# EAGLE design console-dat (EAGLE 7.6.0)

## Sheet 1 of 4
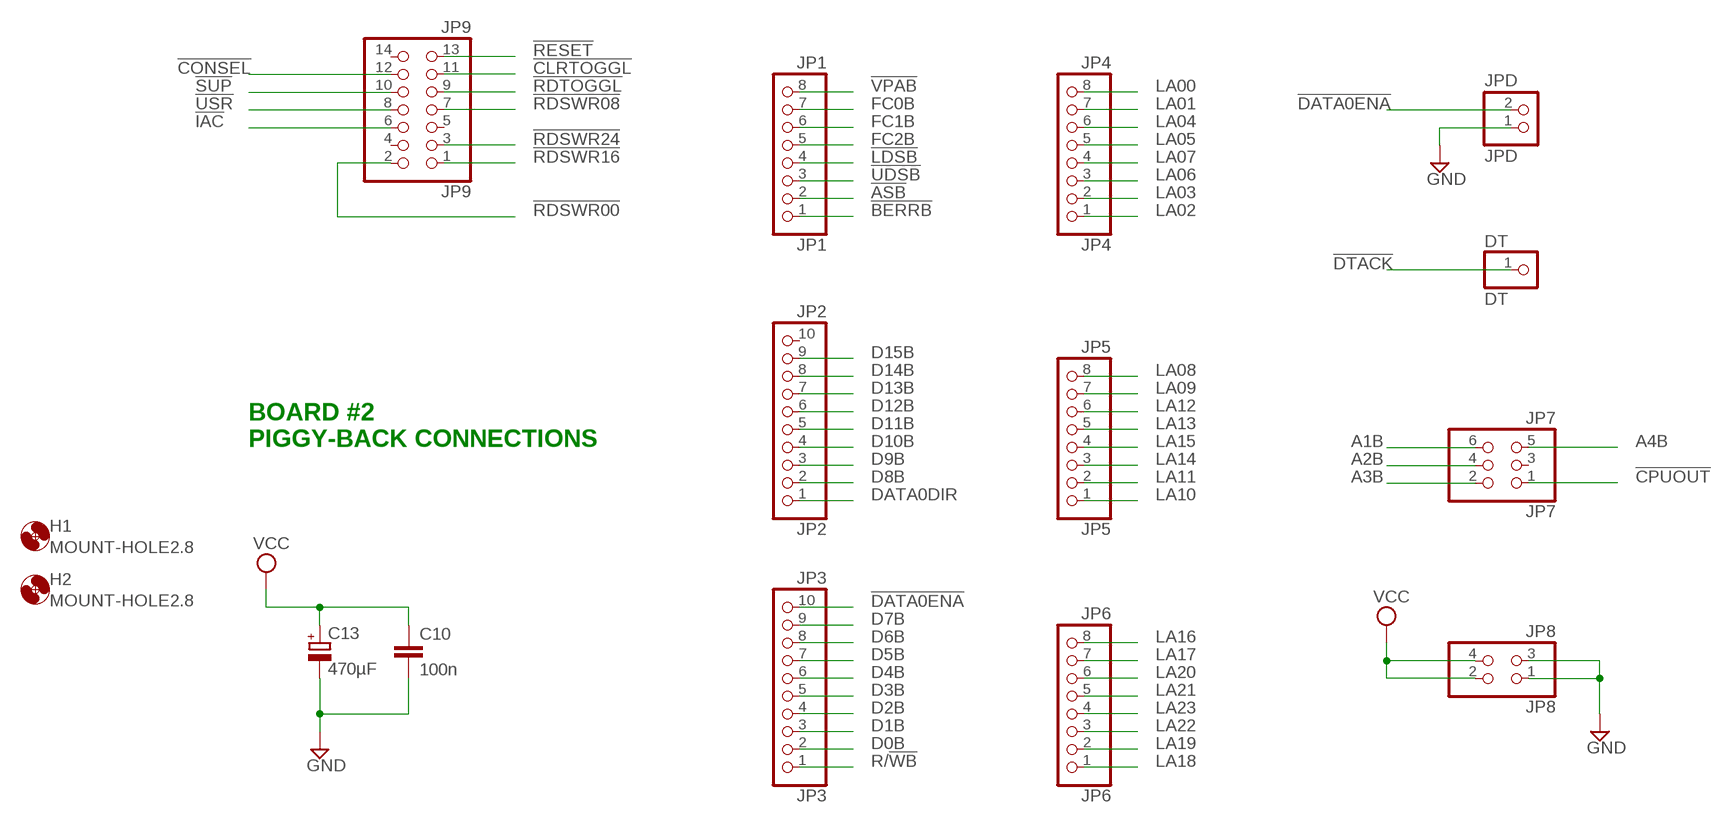
[diagram p0: schematic, sheet 1]

### Parts
C10  100n  C-EU025-024X044  [C025-024X044]
C13  470µF  CPOL-EUE2.5-7  [E2,5-7]
DT  DT  PINHD-1X1  [1X01]
H1  MOUNT-HOLE2.8  [2,8]
H2  MOUNT-HOLE2.8  [2,8]
JP1  JP1  PINHD-1X8  [1X08]
JP2  JP2  PINHD-1X10  [1X10]
JP3  JP3  PINHD-1X10  [1X10]
JP4  JP4  PINHD-1X8  [1X08]
JP5  JP5  PINHD-1X8  [1X08]
JP6  JP6  PINHD-1X8  [1X08]
JP7  JP7  PINHD-2X3  [2X03]
JP8  JP8  PINHD-2X2  [2X02]
JP9  JP9  PINHD-2X7  [2X07]
JPD  JPD  PINHD-1X2  [1X02]

### Nets
!ASB: JP1.2
!BERRB: JP1.1
!CLRTOGGL: JP9.11 ; also sheet 3
!CONSEL: JP9.12 ; also sheet 3
!CPUOUT: JP7.1 ; also sheet 2,3
!DATA0ENA: JP3.10 JPD.2
!DTACK: DT.1 ; also sheet 3
!IAC: JP9.6 ; also sheet 4
!LDSB: JP1.4 ; also sheet 3,4
!RDSWR00: JP9.2 ; also sheet 3
!RDSWR08: JP9.7 ; also sheet 3
!RDSWR16: JP9.1 ; also sheet 3
!RDSWR24: JP9.3 ; also sheet 3
!RDTOGGL: JP9.9 ; also sheet 3
!RESET: JP9.13 ; also sheet 3,4
!SUP: JP9.10 ; also sheet 4
!UDSB: JP1.3 ; also sheet 3,4
!USR: JP9.8 ; also sheet 4
!VPAB: JP1.8 ; also sheet 4
A1B: JP7.6 ; also sheet 3
A2B: JP7.4 ; also sheet 3
A3B: JP7.2 ; also sheet 3
A4B: JP7.5 ; also sheet 3
D0B: JP3.2 ; also sheet 2,4
D1B: JP3.3 ; also sheet 2,4
D2B: JP3.4 ; also sheet 2,4
D3B: JP3.5 ; also sheet 2,4
D4B: JP3.6 ; also sheet 2,4
D5B: JP3.7 ; also sheet 2,4
D6B: JP3.8 ; also sheet 2,4
D7B: JP3.9 ; also sheet 2,4
D8B: JP2.2 ; also sheet 2
D9B: JP2.3 ; also sheet 2
D10B: JP2.4 ; also sheet 2
D11B: JP2.5 ; also sheet 2
D12B: JP2.6 ; also sheet 2
D13B: JP2.7 ; also sheet 2
D14B: JP2.8 ; also sheet 2
D15B: JP2.9 ; also sheet 2
DATA0DIR: JP2.1 ; also sheet 3
FC0B: JP1.7 ; also sheet 4
FC1B: JP1.6 ; also sheet 4
FC2B: JP1.5 ; also sheet 4
GND [Power]: C10.2 C13.- JP8.1 JP8.3 JPD.1 ; also sheet 2,3,4
LA00: JP4.8 ; also sheet 4
LA01: JP4.7 ; also sheet 4
LA02: JP4.1 ; also sheet 4
LA03: JP4.2 ; also sheet 4
LA04: JP4.6 ; also sheet 4
LA05: JP4.5 ; also sheet 4
LA06: JP4.3 ; also sheet 4
LA07: JP4.4 ; also sheet 4
LA08: JP5.8 ; also sheet 4
LA09: JP5.7 ; also sheet 4
LA10: JP5.1 ; also sheet 4
LA11: JP5.2 ; also sheet 4
LA12: JP5.6 ; also sheet 4
LA13: JP5.5 ; also sheet 4
LA14: JP5.3 ; also sheet 4
LA15: JP5.4 ; also sheet 4
LA16: JP6.8 ; also sheet 4
LA17: JP6.7 ; also sheet 4
LA18: JP6.1 ; also sheet 4
LA19: JP6.2 ; also sheet 4
LA20: JP6.6 ; also sheet 4
LA21: JP6.5 ; also sheet 4
LA22: JP6.3 ; also sheet 4
LA23: JP6.4 ; also sheet 4
R/!WB: JP3.1 ; also sheet 3,4
VCC [Power]: C10.1 C13.+ JP8.2 JP8.4 ; also sheet 2,3,4
Unconnected: JP2.10 JP7.3 JP9.4 JP9.5 JP9.14

### Notes on the sheet
- BOARD #2
  PIGGY-BACK CONNECTIONS

## Sheet 2 of 4
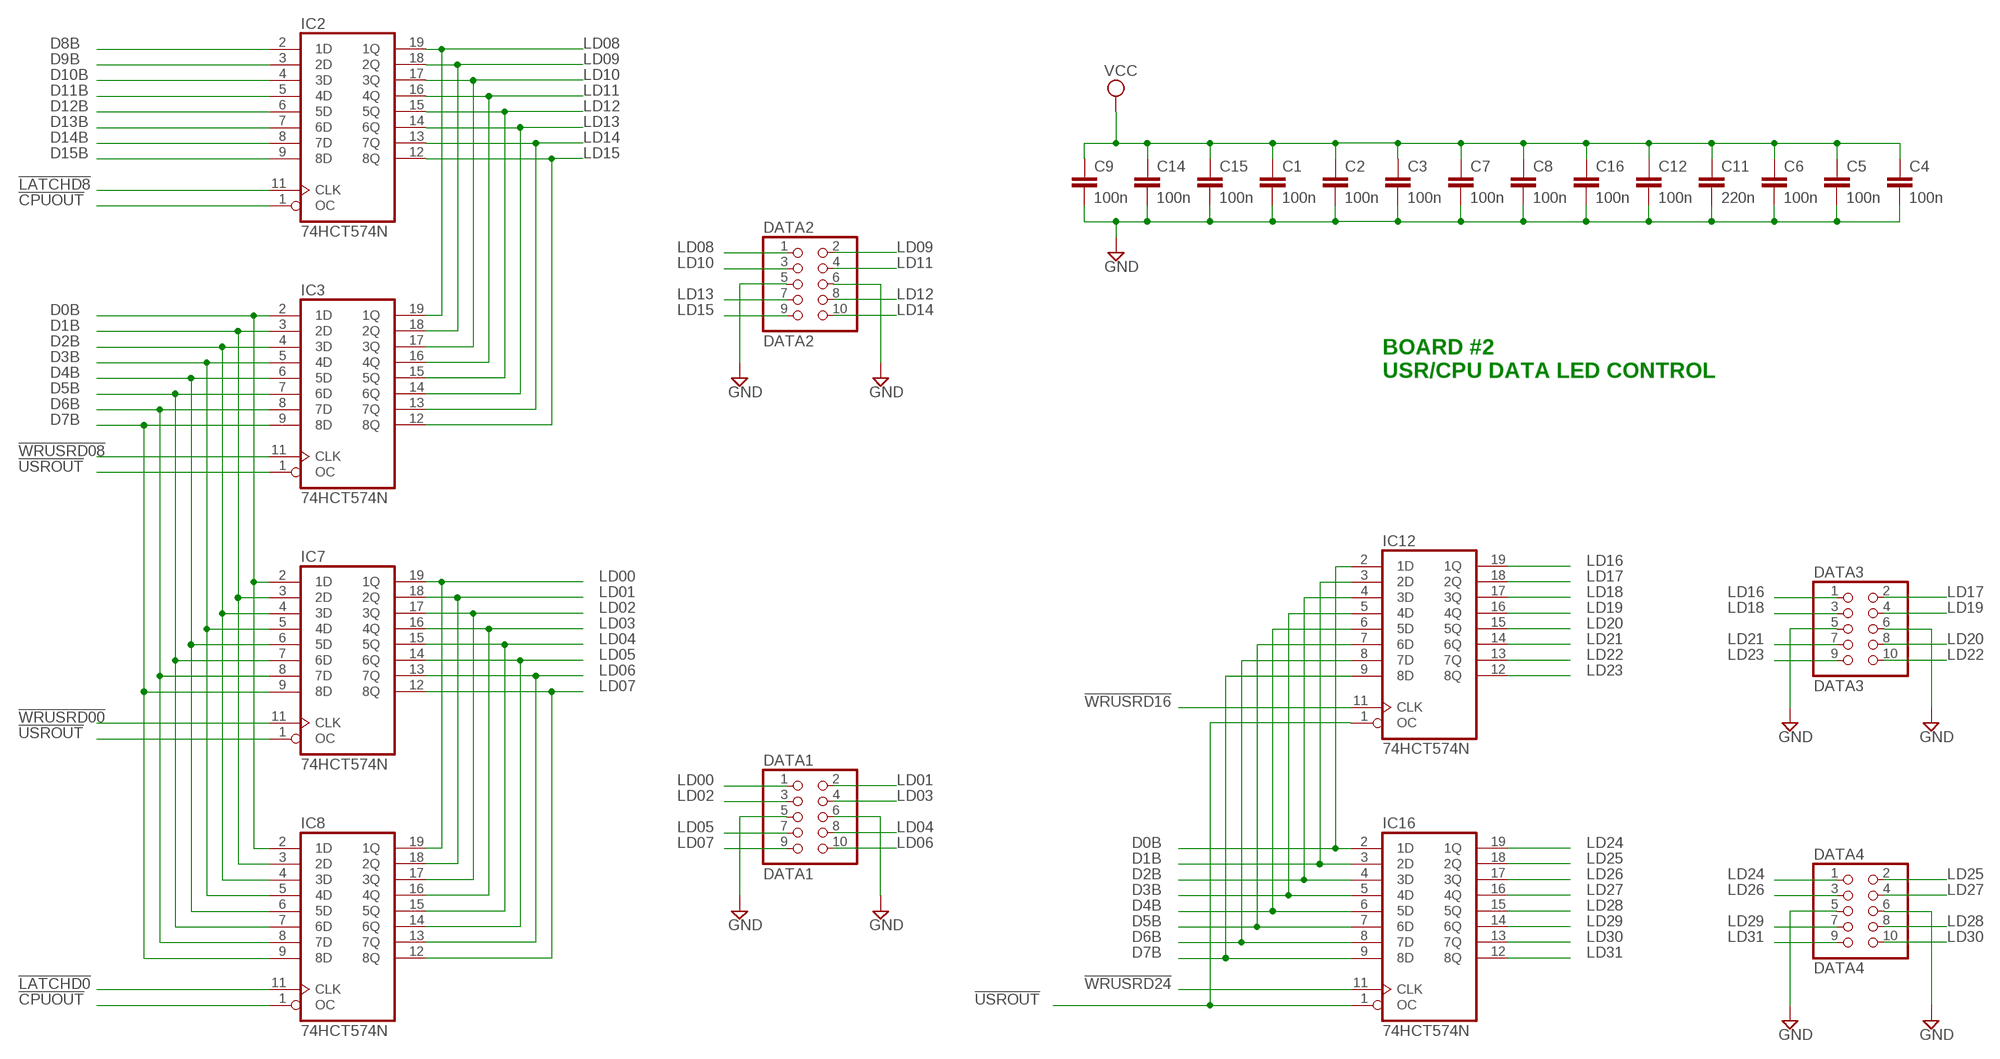
[diagram p1: schematic, sheet 2]

### Parts
C1  100n  C-EU025-024X044  [C025-024X044]
C2  100n  C-EU025-024X044  [C025-024X044]
C3  100n  C-EU025-024X044  [C025-024X044]
C4  100n  C-EU025-024X044  [C025-024X044]
C5  100n  C-EU025-024X044  [C025-024X044]
C6  100n  C-EU025-024X044  [C025-024X044]
C7  100n  C-EU025-024X044  [C025-024X044]
C8  100n  C-EU025-024X044  [C025-024X044]
C9  100n  C-EU025-024X044  [C025-024X044]
C11  220n  C-EU025-024X044  [C025-024X044]
C12  100n  C-EU025-024X044  [C025-024X044]
C14  100n  C-EU025-024X044  [C025-024X044]
C15  100n  C-EU025-024X044  [C025-024X044]
C16  100n  C-EU025-024X044  [C025-024X044]
DATA1  DATA1  PINHD-2X5  [2X05]
DATA2  DATA2  PINHD-2X5  [2X05]
DATA3  DATA3  PINHD-2X5  [2X05]
DATA4  DATA4  PINHD-2X5  [2X05]
IC2  74HCT574N  [DIL20]
IC3  74HCT574N  [DIL20]
IC7  74HCT574N  [DIL20]
IC8  74HCT574N  [DIL20]
IC12  74HCT574N  [DIL20]
IC16  74HCT574N  [DIL20]

### Nets
!CPUOUT: IC2.1(OC) IC8.1(OC) ; also sheet 1,3
!LATCHD0: IC8.11(CLK) ; also sheet 3
!LATCHD8: IC2.11(CLK) ; also sheet 3
!USROUT: IC3.1(OC) IC7.1(OC) IC12.1(OC) IC16.1(OC) ; also sheet 3,4
!WRUSRD00: IC7.11(CLK) ; also sheet 3
!WRUSRD08: IC3.11(CLK) ; also sheet 3
!WRUSRD16: IC12.11(CLK) ; also sheet 3
!WRUSRD24: IC16.11(CLK) ; also sheet 3
D0B: IC3.2(1D) IC7.2(1D) IC8.2(1D) IC12.2(1D) IC16.2(1D) ; also sheet 1,4
D1B: IC3.3(2D) IC7.3(2D) IC8.3(2D) IC12.3(2D) IC16.3(2D) ; also sheet 1,4
D2B: IC3.4(3D) IC7.4(3D) IC8.4(3D) IC12.4(3D) IC16.4(3D) ; also sheet 1,4
D3B: IC3.5(4D) IC7.5(4D) IC8.5(4D) IC12.5(4D) IC16.5(4D) ; also sheet 1,4
D4B: IC3.6(5D) IC7.6(5D) IC8.6(5D) IC12.6(5D) IC16.6(5D) ; also sheet 1,4
D5B: IC3.7(6D) IC7.7(6D) IC8.7(6D) IC12.7(6D) IC16.7(6D) ; also sheet 1,4
D6B: IC3.8(7D) IC7.8(7D) IC8.8(7D) IC12.8(7D) IC16.8(7D) ; also sheet 1,4
D7B: IC3.9(8D) IC7.9(8D) IC8.9(8D) IC12.9(8D) IC16.9(8D) ; also sheet 1,4
D8B: IC2.2(1D) ; also sheet 1
D9B: IC2.3(2D) ; also sheet 1
D10B: IC2.4(3D) ; also sheet 1
D11B: IC2.5(4D) ; also sheet 1
D12B: IC2.6(5D) ; also sheet 1
D13B: IC2.7(6D) ; also sheet 1
D14B: IC2.8(7D) ; also sheet 1
D15B: IC2.9(8D) ; also sheet 1
GND [Power]: C1.2 C2.2 C3.2 C4.2 C5.2 C6.2 C7.2 C8.2 C9.2 C11.2 C12.2 C14.2 C15.2 C16.2 DATA1.5 DATA1.6 DATA2.5 DATA2.6 DATA3.5 DATA3.6 DATA4.5 DATA4.6 ; also sheet 1,3,4
LD00: DATA1.1 IC7.19(1Q) IC8.19(1Q)
LD01: DATA1.2 IC7.18(2Q) IC8.18(2Q)
LD02: DATA1.3 IC7.17(3Q) IC8.17(3Q)
LD03: DATA1.4 IC7.16(4Q) IC8.16(4Q)
LD04: DATA1.8 IC7.15(5Q) IC8.15(5Q)
LD05: DATA1.7 IC7.14(6Q) IC8.14(6Q)
LD06: DATA1.10 IC7.13(7Q) IC8.13(7Q)
LD07: DATA1.9 IC7.12(8Q) IC8.12(8Q)
LD08: DATA2.1 IC2.19(1Q) IC3.19(1Q)
LD09: DATA2.2 IC2.18(2Q) IC3.18(2Q)
LD10: DATA2.3 IC2.17(3Q) IC3.17(3Q)
LD11: DATA2.4 IC2.16(4Q) IC3.16(4Q)
LD12: DATA2.8 IC2.15(5Q) IC3.15(5Q)
LD13: DATA2.7 IC2.14(6Q) IC3.14(6Q)
LD14: DATA2.10 IC2.13(7Q) IC3.13(7Q)
LD15: DATA2.9 IC2.12(8Q) IC3.12(8Q)
LD16: DATA3.1 IC12.19(1Q)
LD17: DATA3.2 IC12.18(2Q)
LD18: DATA3.3 IC12.17(3Q)
LD19: DATA3.4 IC12.16(4Q)
LD20: DATA3.8 IC12.15(5Q)
LD21: DATA3.7 IC12.14(6Q)
LD22: DATA3.10 IC12.13(7Q)
LD23: DATA3.9 IC12.12(8Q)
LD24: DATA4.1 IC16.19(1Q)
LD25: DATA4.2 IC16.18(2Q)
LD26: DATA4.3 IC16.17(3Q)
LD27: DATA4.4 IC16.16(4Q)
LD28: DATA4.8 IC16.15(5Q)
LD29: DATA4.7 IC16.14(6Q)
LD30: DATA4.10 IC16.13(7Q)
LD31: DATA4.9 IC16.12(8Q)
VCC [Power]: C1.1 C2.1 C3.1 C4.1 C5.1 C6.1 C7.1 C8.1 C9.1 C11.1 C12.1 C14.1 C15.1 C16.1 ; also sheet 1,3,4

### Notes on the sheet
- BOARD #2
  USR/CPU DATA LED CONTROL

## Sheet 3 of 4
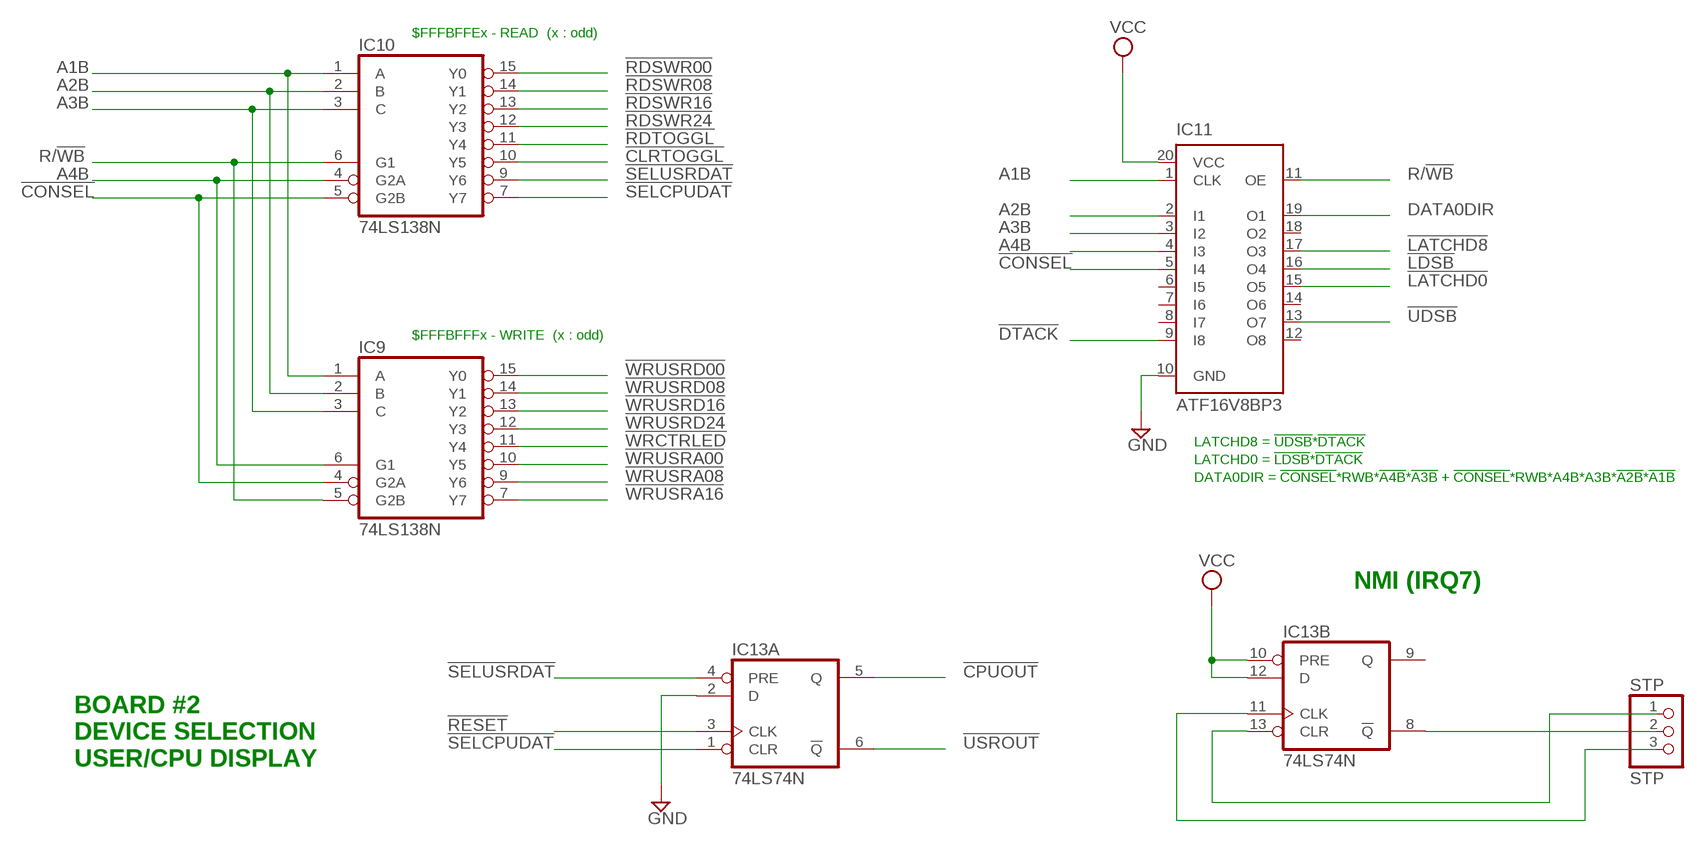
[diagram p2: schematic, sheet 3]

### Parts
IC9  74LS138N  [DIL16]
IC10  74LS138N  [DIL16]
IC11  ATF16V8BP3  [DIL20]
IC13  74LS74N  [DIL14]
STP  STP  PINHD-1X3  [1X03]

### Nets
!CLRTOGGL: IC10.10(Y5) ; also sheet 1
!CONSEL: IC9.4(G2A) IC10.5(G2B) IC11.5(I4) ; also sheet 1
!CPUOUT: IC13.5(A:Q) ; also sheet 1,2
!DTACK: IC11.9(I8) ; also sheet 1
!LATCHD0: IC11.15(O5) ; also sheet 2
!LATCHD8: IC11.17(O3) ; also sheet 2
!LDSB: IC11.16(O4) ; also sheet 1,4
!RDSWR00: IC10.15(Y0) ; also sheet 1
!RDSWR08: IC10.14(Y1) ; also sheet 1
!RDSWR16: IC10.13(Y2) ; also sheet 1
!RDSWR24: IC10.12(Y3) ; also sheet 1
!RDTOGGL: IC10.11(Y4) ; also sheet 1
!RESET: IC13.3(A:CLK) ; also sheet 1,4
!SELCPUDAT: IC10.7(Y7) IC13.1(A:CLR)
!SELUSRDAT: IC10.9(Y6) IC13.4(A:PRE)
!UDSB: IC11.13(O7) ; also sheet 1,4
!USROUT: IC13.6(A:!Q) ; also sheet 2,4
!WRCTRLED: IC9.11(Y4) ; also sheet 4
!WRUSRA00: IC9.10(Y5) ; also sheet 4
!WRUSRA08: IC9.9(Y6) ; also sheet 4
!WRUSRA16: IC9.7(Y7) ; also sheet 4
!WRUSRD00: IC9.15(Y0) ; also sheet 2
!WRUSRD08: IC9.14(Y1) ; also sheet 2
!WRUSRD16: IC9.13(Y2) ; also sheet 2
!WRUSRD24: IC9.12(Y3) ; also sheet 2
A1B: IC9.1(A) IC10.1(A) IC11.1(CLK) ; also sheet 1
A2B: IC9.2(B) IC10.2(B) IC11.2(I1) ; also sheet 1
A3B: IC9.3(C) IC10.3(C) IC11.3(I2) ; also sheet 1
A4B: IC9.6(G1) IC10.4(G2A) IC11.4(I3) ; also sheet 1
DATA0DIR: IC11.19(O1) ; also sheet 1
GND [Power]: IC11.10(GND) IC13.2(A:D) ; also sheet 1,2,4
N$31: IC13.11(B:CLK) STP.3
N$32: IC13.8(B:!Q) STP.2
N$33: IC13.13(B:CLR) STP.1
R/!WB: IC9.5(G2B) IC10.6(G1) IC11.11(OE) ; also sheet 1,4
VCC [Power]: IC11.20(VCC) IC13.10(B:PRE) IC13.12(B:D) ; also sheet 1,2,4
Unconnected: IC11.6(I5) IC11.7(I6) IC11.8(I7) IC11.12(O8) IC11.14(O6) IC11.18(O2) IC13.9(B:Q)

### Notes on the sheet
- $FFFBFFEx - READ  (x : odd)
- $FFFBFFFx - WRITE  (x : odd)
- LATCHD8 = !UDSB!*!DTACK
- LATCHD0 = !LDSB!*!DTACK
- DATA0DIR = !CONSEL!*RWB*!A4B!*!A3B! + !CONSEL!*RWB*A4B*A3B*!A2B!*!A1B!
- NMI (IRQ7)
- BOARD #2
  DEVICE SELECTION
  USER/CPU DISPLAY

## Sheet 4 of 4
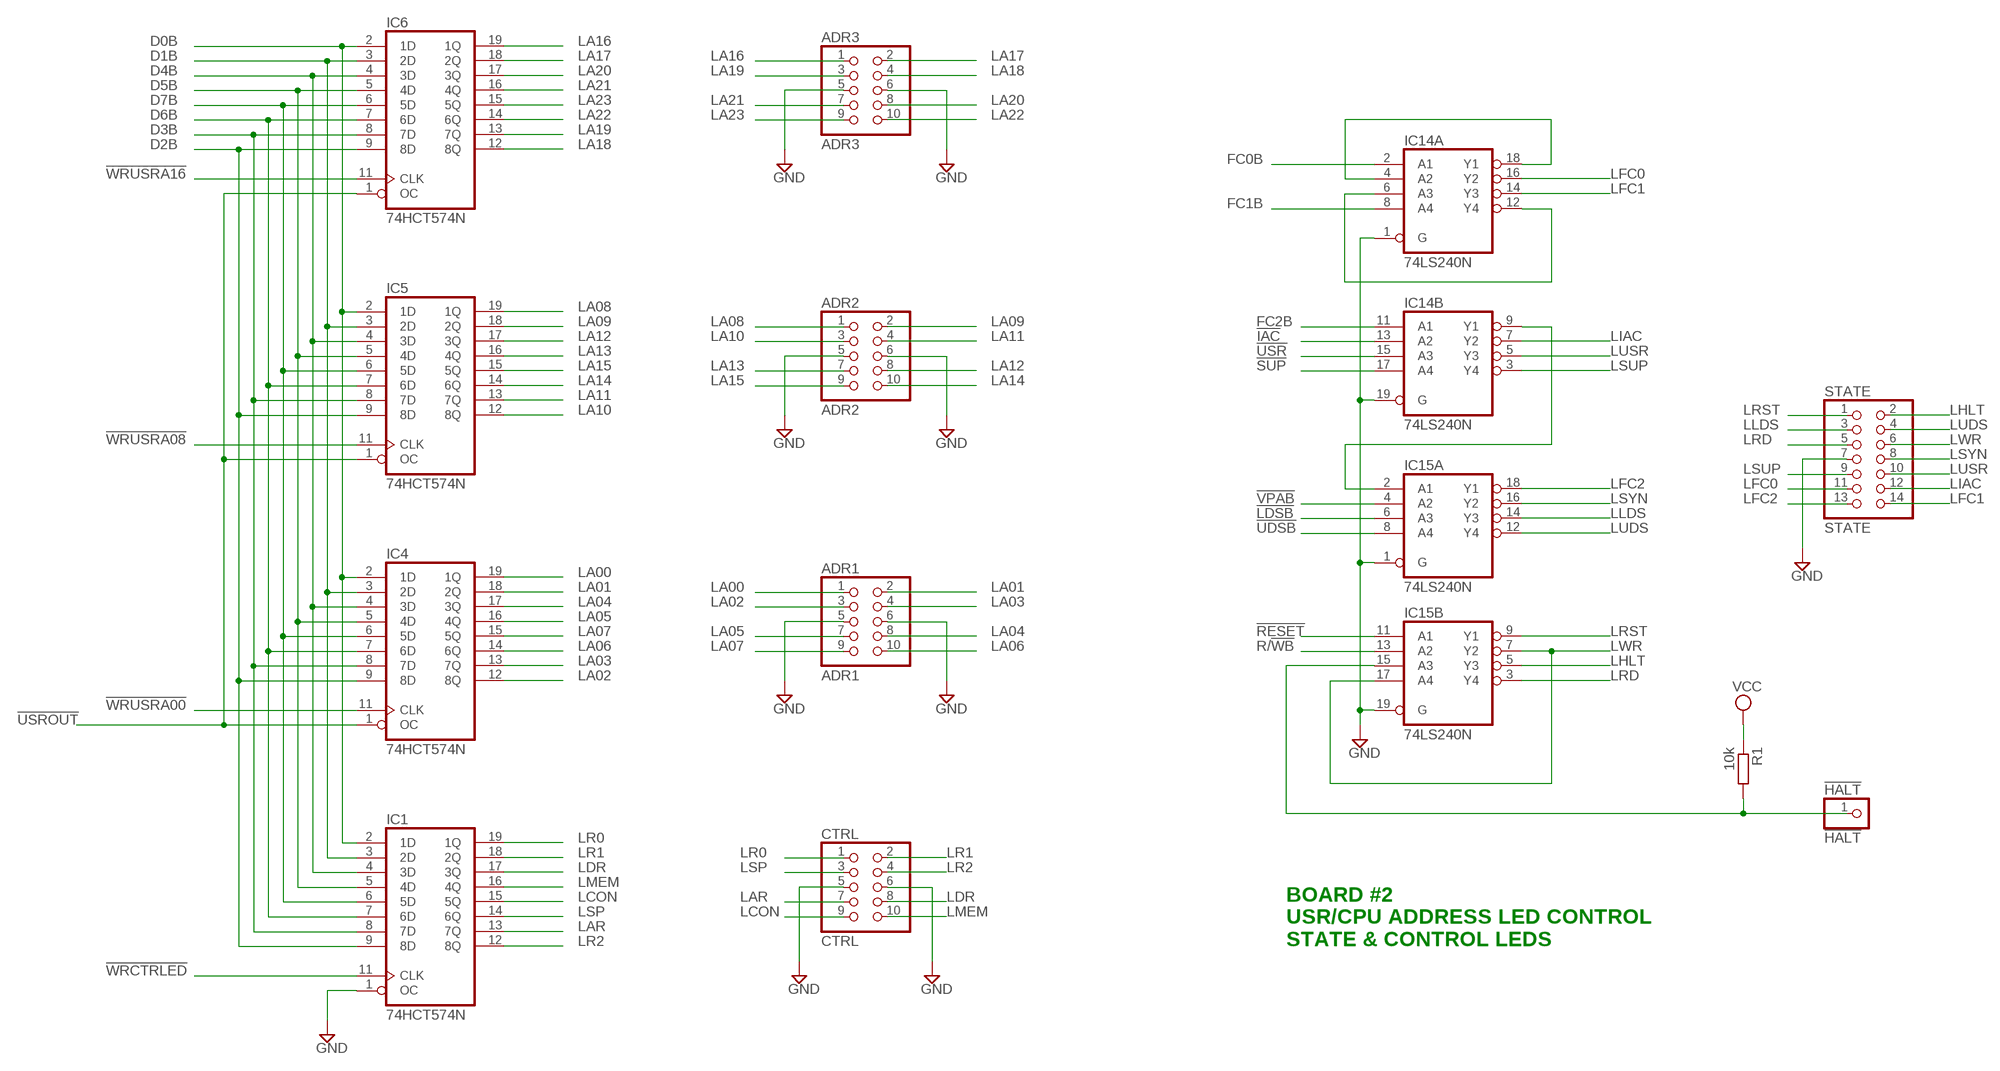
[diagram p3: schematic, sheet 4]

### Parts
!HALT  !HALT  PINHD-1X1  [1X01]
ADR1  ADR1  PINHD-2X5  [2X05]
ADR2  ADR2  PINHD-2X5  [2X05]
ADR3  ADR3  PINHD-2X5  [2X05]
CTRL  CTRL  PINHD-2X5  [2X05]
IC1  74HCT574N  [DIL20]
IC4  74HCT574N  [DIL20]
IC5  74HCT574N  [DIL20]
IC6  74HCT574N  [DIL20]
IC14  74LS240N  [DIL20]
IC15  74LS240N  [DIL20]
R1  10k  R-EU_0204/7  [0204/7]
STATE  STATE  PINHD-2X7  [2X07]

### Nets
!IAC: IC14.13(B:A2) ; also sheet 1
!LDSB: IC15.6(A:A3) ; also sheet 1,3
!RESET: IC15.11(B:A1) ; also sheet 1,3
!SUP: IC14.17(B:A4) ; also sheet 1
!UDSB: IC15.8(A:A4) ; also sheet 1,3
!USR: IC14.15(B:A3) ; also sheet 1
!USROUT: IC4.1(OC) IC5.1(OC) IC6.1(OC) ; also sheet 2,3
!VPAB: IC15.4(A:A2) ; also sheet 1
!WRCTRLED: IC1.11(CLK) ; also sheet 3
!WRUSRA00: IC4.11(CLK) ; also sheet 3
!WRUSRA08: IC5.11(CLK) ; also sheet 3
!WRUSRA16: IC6.11(CLK) ; also sheet 3
D0B: IC1.2(1D) IC4.2(1D) IC5.2(1D) IC6.2(1D) ; also sheet 1,2
D1B: IC1.3(2D) IC4.3(2D) IC5.3(2D) IC6.3(2D) ; also sheet 1,2
D2B: IC1.9(8D) IC4.9(8D) IC5.9(8D) IC6.9(8D) ; also sheet 1,2
D3B: IC1.8(7D) IC4.8(7D) IC5.8(7D) IC6.8(7D) ; also sheet 1,2
D4B: IC1.4(3D) IC4.4(3D) IC5.4(3D) IC6.4(3D) ; also sheet 1,2
D5B: IC1.5(4D) IC4.5(4D) IC5.5(4D) IC6.5(4D) ; also sheet 1,2
D6B: IC1.7(6D) IC4.7(6D) IC5.7(6D) IC6.7(6D) ; also sheet 1,2
D7B: IC1.6(5D) IC4.6(5D) IC5.6(5D) IC6.6(5D) ; also sheet 1,2
FC0B: IC14.2(A:A1) ; also sheet 1
FC1B: IC14.8(A:A4) ; also sheet 1
FC2B: IC14.11(B:A1) ; also sheet 1
GND [Power]: ADR1.5 ADR1.6 ADR2.5 ADR2.6 ADR3.5 ADR3.6 CTRL.5 CTRL.6 IC1.1(OC) IC14.1(A:G) IC14.19(B:G) IC15.1(A:G) IC15.19(B:G) STATE.7 ; also sheet 1,2,3
LA00: ADR1.1 IC4.19(1Q) ; also sheet 1
LA01: ADR1.2 IC4.18(2Q) ; also sheet 1
LA02: ADR1.3 IC4.12(8Q) ; also sheet 1
LA03: ADR1.4 IC4.13(7Q) ; also sheet 1
LA04: ADR1.8 IC4.17(3Q) ; also sheet 1
LA05: ADR1.7 IC4.16(4Q) ; also sheet 1
LA06: ADR1.10 IC4.14(6Q) ; also sheet 1
LA07: ADR1.9 IC4.15(5Q) ; also sheet 1
LA08: ADR2.1 IC5.19(1Q) ; also sheet 1
LA09: ADR2.2 IC5.18(2Q) ; also sheet 1
LA10: ADR2.3 IC5.12(8Q) ; also sheet 1
LA11: ADR2.4 IC5.13(7Q) ; also sheet 1
LA12: ADR2.8 IC5.17(3Q) ; also sheet 1
LA13: ADR2.7 IC5.16(4Q) ; also sheet 1
LA14: ADR2.10 IC5.14(6Q) ; also sheet 1
LA15: ADR2.9 IC5.15(5Q) ; also sheet 1
LA16: ADR3.1 IC6.19(1Q) ; also sheet 1
LA17: ADR3.2 IC6.18(2Q) ; also sheet 1
LA18: ADR3.4 IC6.12(8Q) ; also sheet 1
LA19: ADR3.3 IC6.13(7Q) ; also sheet 1
LA20: ADR3.8 IC6.17(3Q) ; also sheet 1
LA21: ADR3.7 IC6.16(4Q) ; also sheet 1
LA22: ADR3.10 IC6.14(6Q) ; also sheet 1
LA23: ADR3.9 IC6.15(5Q) ; also sheet 1
LAR: CTRL.7 IC1.13(7Q)
LCON: CTRL.9 IC1.15(5Q)
LDR: CTRL.8 IC1.17(3Q)
LFC0: IC14.16(A:Y2) STATE.11
LFC1: IC14.14(A:Y3) STATE.14
LFC2: IC15.18(A:Y1) STATE.13
LHLT: IC15.5(B:Y3) STATE.2
LIAC: IC14.7(B:Y2) STATE.12
LLDS: IC15.14(A:Y3) STATE.3
LMEM: CTRL.10 IC1.16(4Q)
LR0: CTRL.1 IC1.19(1Q)
LR1: CTRL.2 IC1.18(2Q)
LR2: CTRL.4 IC1.12(8Q)
LRD: IC15.3(B:Y4) STATE.5
LRST: IC15.9(B:Y1) STATE.1
LSP: CTRL.3 IC1.14(6Q)
LSUP: IC14.3(B:Y4) STATE.9
LSYN: IC15.16(A:Y2) STATE.8
LUDS: IC15.12(A:Y4) STATE.4
LUSR: IC14.5(B:Y3) STATE.10
LWR: IC15.7(B:Y2) IC15.17(B:A4) STATE.6
N$1: IC14.4(A:A2) IC14.18(A:Y1)
N$2: IC14.9(B:Y1) IC15.2(A:A1)
N$3: IC14.6(A:A3) IC14.12(A:Y4)
N$4: !HALT.1 IC15.15(B:A3) R1.2
R/!WB: IC15.13(B:A2) ; also sheet 1,3
VCC [Power]: R1.1 ; also sheet 1,2,3

### Notes on the sheet
- BOARD #2
  USR/CPU ADDRESS LED CONTROL
  STATE & CONTROL LEDS

## Power pins joined to a net without a drawn wire
GND: IC1.10(GND) IC2.10(GND) IC3.10(GND) IC4.10(GND) IC5.10(GND) IC6.10(GND) IC7.10(GND) IC8.10(GND) IC9.8(GND) IC10.8(GND) IC12.10(GND) IC13.7(P:GND) IC14.10(P:GND) IC15.10(P:GND) IC16.10(GND)
VCC: IC1.20(VCC) IC2.20(VCC) IC3.20(VCC) IC4.20(VCC) IC5.20(VCC) IC6.20(VCC) IC7.20(VCC) IC8.20(VCC) IC9.16(VCC) IC10.16(VCC) IC12.20(VCC) IC13.14(P:VCC) IC14.20(P:VCC) IC15.20(P:VCC) IC16.20(VCC)

## Library data of the parts
!HALT DT = pinhead:PINHD-1X1: PIN HEADER
ADR1-ADR3 CTRL DATA1-DATA4 = pinhead:PINHD-2X5: PIN HEADER
C1-C12 C14-C16 = rcl:C-EU: CAPACITOR, European symbol
C13 = rcl:CPOL-EU: POLARIZED CAPACITOR, European symbol
H1 H2 = holes:MOUNT-HOLE: MOUNTING HOLE with drill center marker
IC1-IC8 IC12 IC16 = 74xx-eu:74*574: 8-bit D type FLIP FLOP bus driver
IC9 IC10 = 74xx-eu:74*138: 3-line to 8-line DECODER/DEMULTIPLEXER
IC11 = atmel:ATF16V8B: High perfomance CMOS (electrically erasable) programmable logic device (PLD) ABLE-Atmel-ABEL - P18V8R, P16V8C, P16V8AS, P17V8 COPL Atmel-WinCUPL - G16V8MS, G16V8MA, G16V8AS, G16V8 LOG/IC - GAL16V8_R, GAL16V8_G7, GAL16V8_C), GAL16V8 Tango-PLD - G16V8R, G16V8C, G16V8AS, G16V8 Source: http://www.atmel.com/dyn/resources/prod_documents/DOC0364.PDF; MPN: ATF16V8CZ-15PU; OC_FARNELL: 1551768; OC_NEWARK: 94M6254
IC13 = 74xx-eu:74*74: Dual D type positive edge triggered FLIP FLOP, preset and clear
IC14 IC15 = 74xx-eu:74*240: Octal BUFFER and LINE DRIVER, 3-state
JP1 JP4-JP6 = pinhead:PINHD-1X8: PIN HEADER
JP2 JP3 = pinhead:PINHD-1X10: PIN HEADER
JP7 = pinhead:PINHD-2X3: PIN HEADER
JP8 = pinhead:PINHD-2X2: PIN HEADER
JP9 STATE = pinhead:PINHD-2X7: PIN HEADER
JPD = pinhead:PINHD-1X2: PIN HEADER
R1 = rcl:R-EU_: RESISTOR, European symbol
STP = pinhead:PINHD-1X3: PIN HEADER

## Net classes
0 default: width 0.254 mm, drill 0.203 mm, clearance 0.254 mm
1 Power: width 0.508 mm, drill 0.254 mm, clearance 0.254 mm

## Board
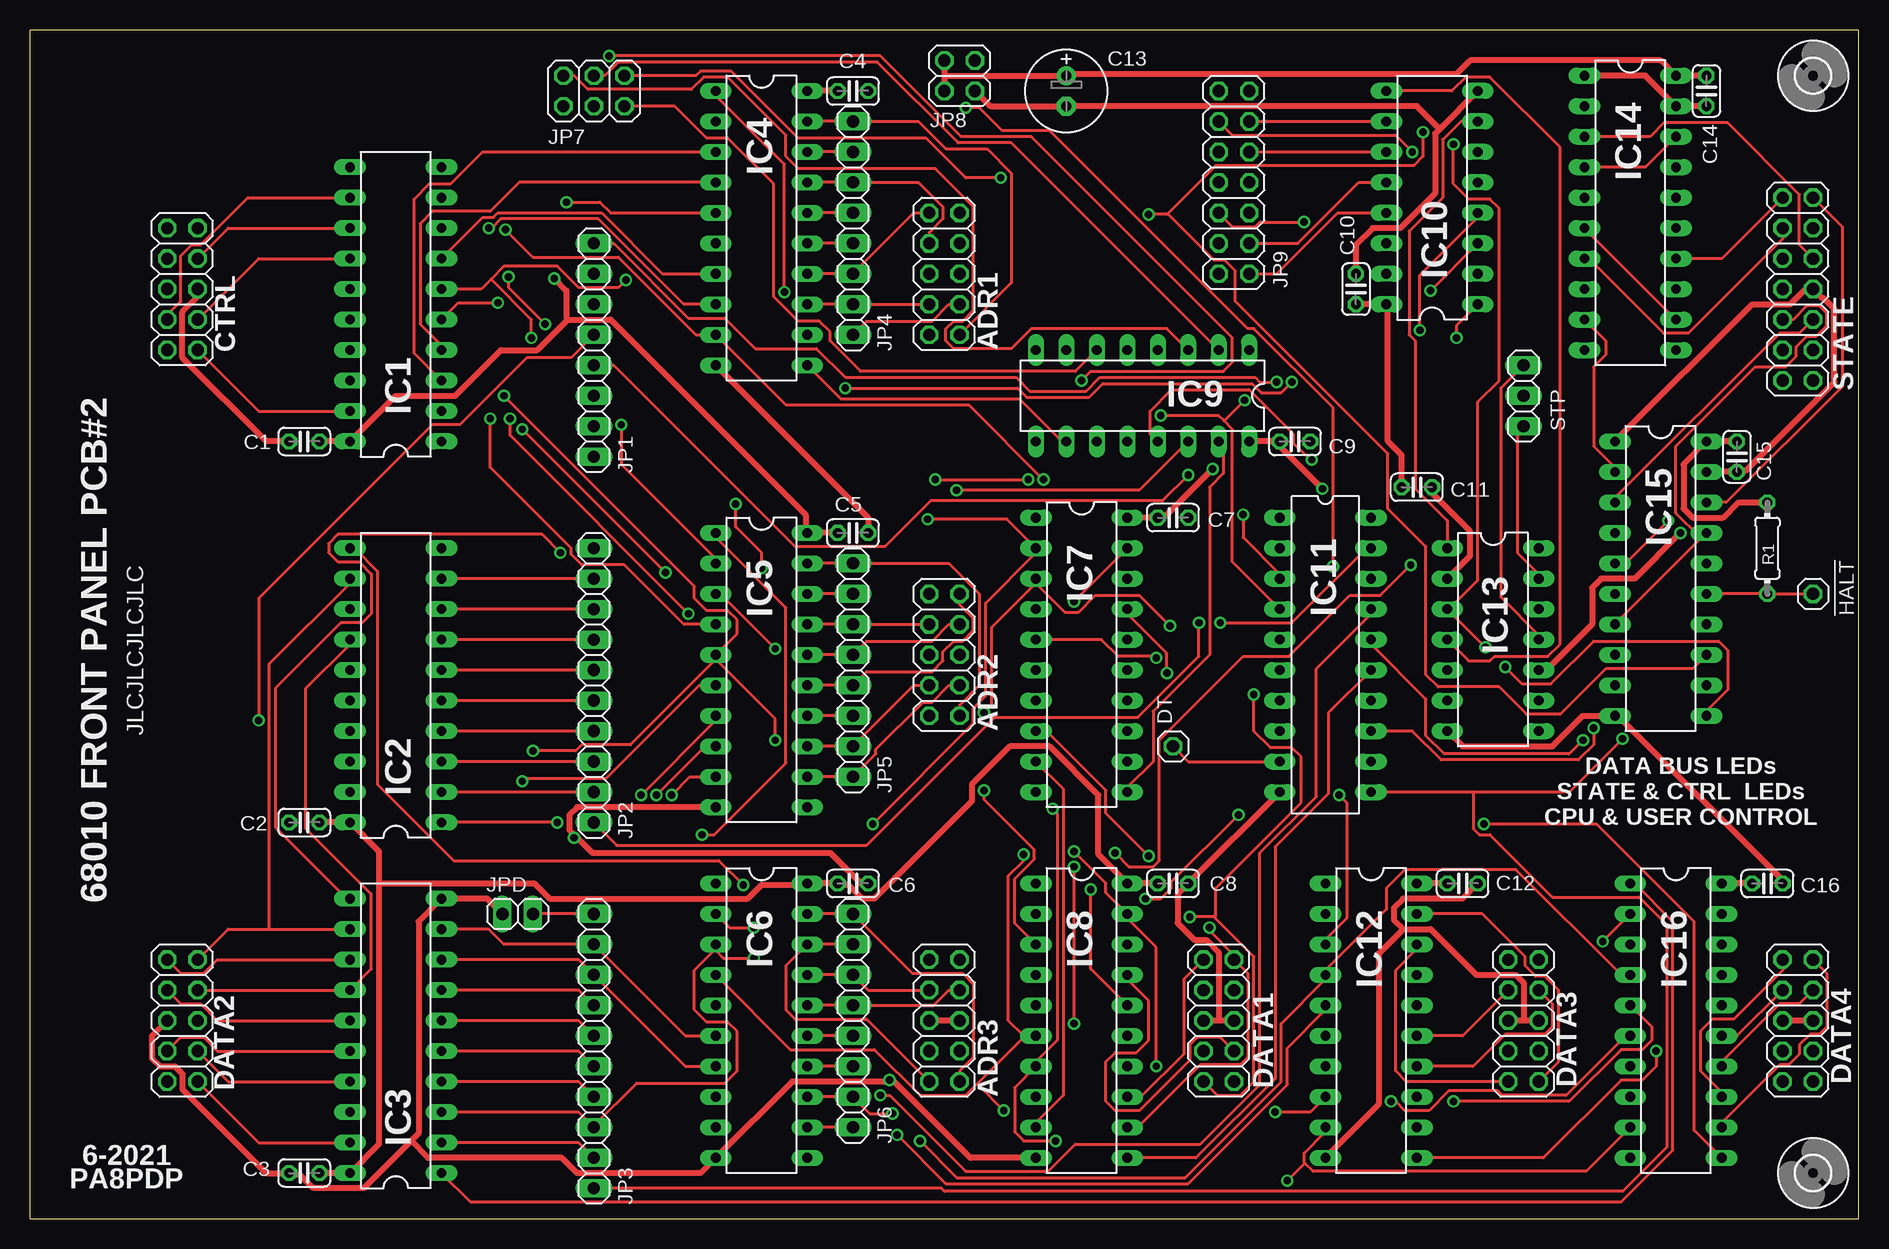
[diagram p4: board, top side]
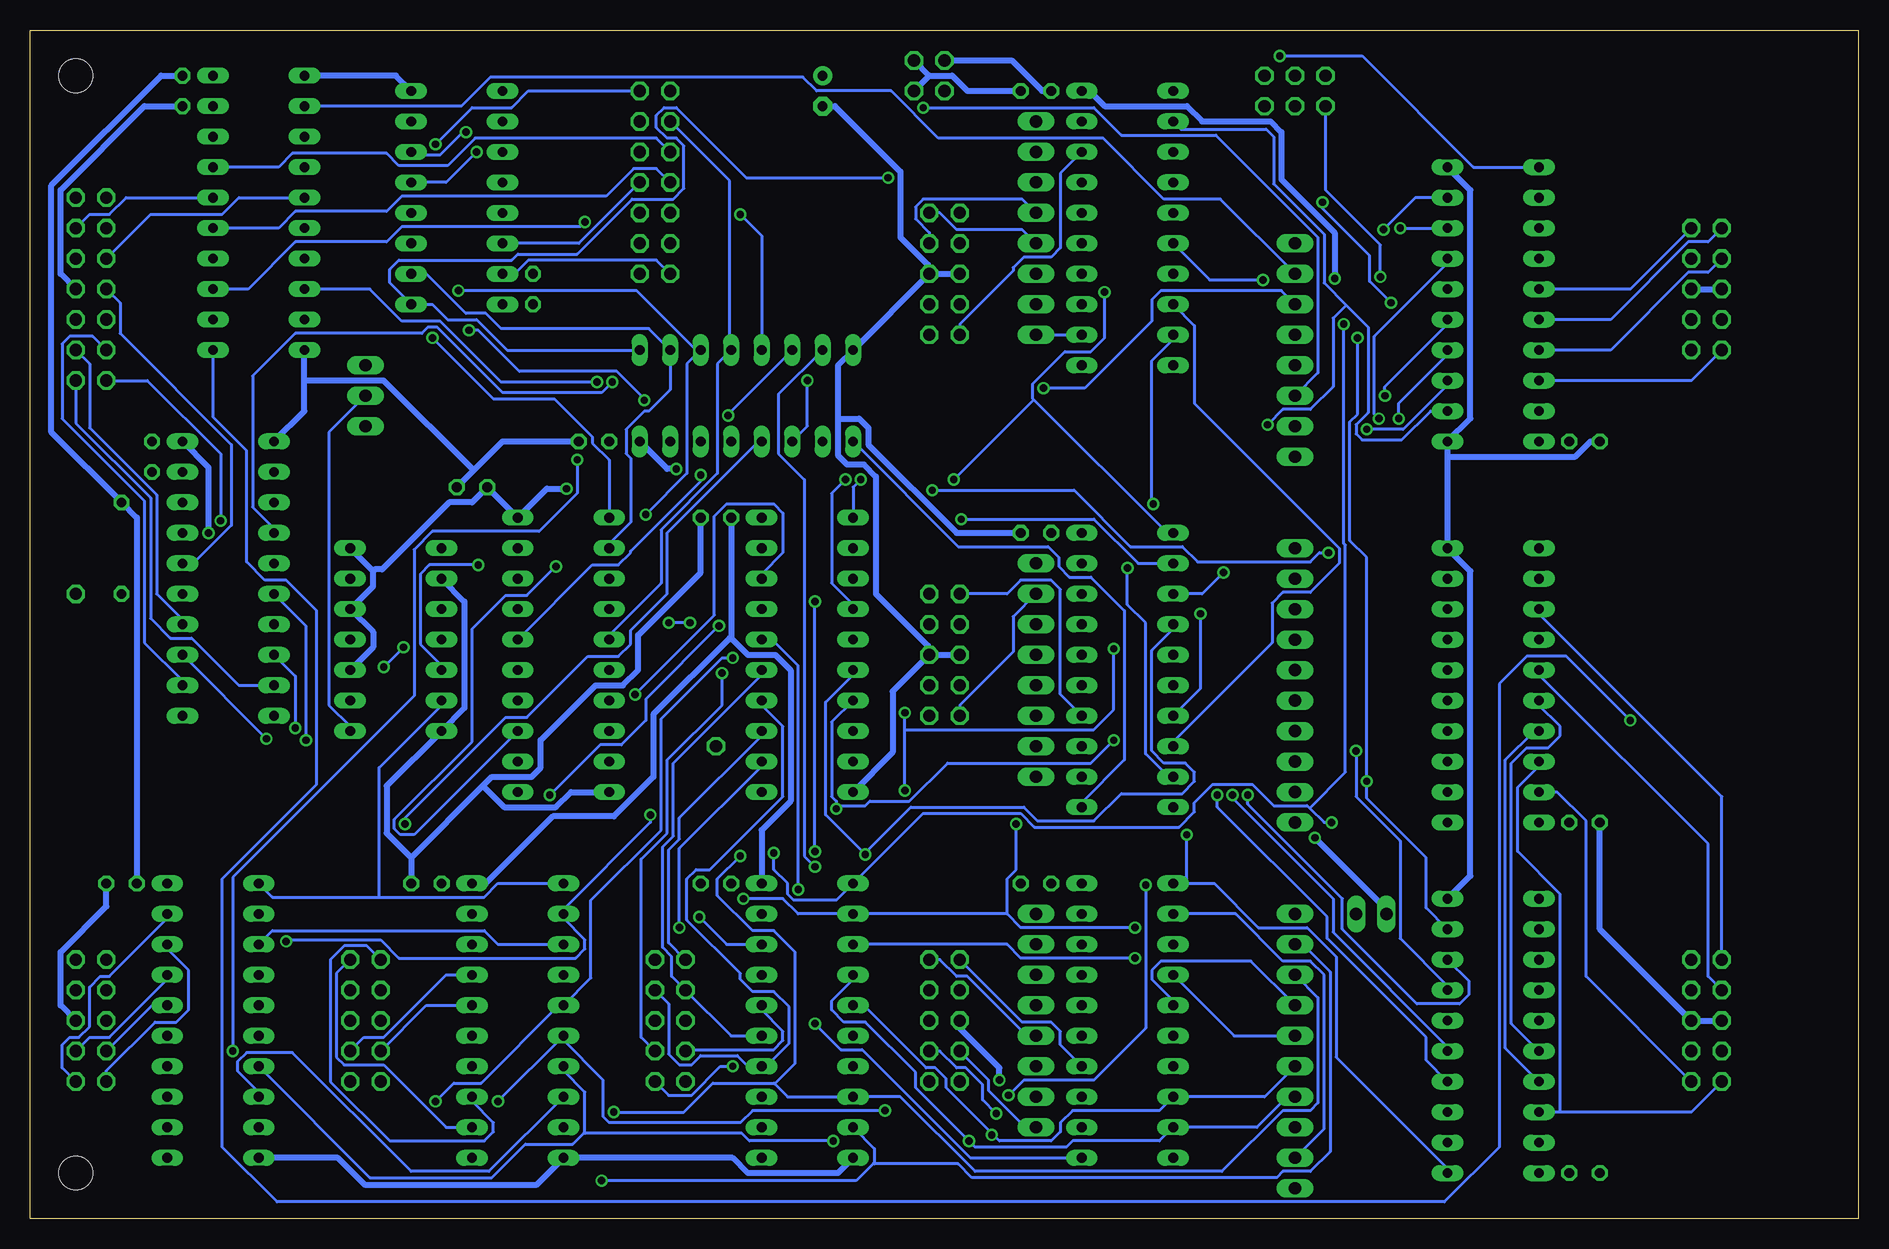
[diagram p5: board, bottom side, seen from below]

Size 152.41 x 99.06 mm. Coordinates in mm from the lower left corner, seen from the top.
Outline: 0,0 152.41,0.01
Outline: 0,0 0,99.06 152.4,99.06 152.4,0
Copper layers (1*16): Top 0.035mm / dielectric 1.5mm / Bottom 0.035mm
Design rules "default": minimum track width 10mil, minimum drill 24mil, track to track 8mil, track to pad 8mil, pad to pad 8mil, via to via 8mil, smd to smd 8mil, copper to edge 40mil, drill to drill 8mil, minimum pad ring 10mil, minimum via ring 8mil, stop-mask expansion 4mil, vias tented up to drill 0mil, thermal gap 10mil

### Footprints (pad centres in the part's own frame; a part is rotated, then mirrored left to right if it is on the bottom)
1X01 = drill 1.016 octagon: 1 0,0
2X05 = drill 1.016 octagon: 1 -5.08,-1.27; 2 -5.08,1.27; 3 -2.54,-1.27; 4 -2.54,1.27; 5 0,-1.27; 6 0,1.27; 7 2.54,-1.27; 8 2.54,1.27; 9 5.08,-1.27; 10 5.08,1.27
C025-024X044 = drill 0.813 octagon: 1 -1.27,0; 2 1.27,0
E2,5-7 = drill 0.813 pad 1.6: + -1.27,0 | drill 0.813 pad 1.6 octagon: - 1.27,0
2,8 = hole 2.8: 0,0
DIL20 = drill 0.813 long: 1 -11.43,-3.81; 2 -8.89,-3.81; 3 -6.35,-3.81; 4 -3.81,-3.81; 5 -1.27,-3.81; 6 1.27,-3.81; 7 3.81,-3.81; 8 6.35,-3.81; 9 8.89,-3.81; 10 11.43,-3.81; 11 11.43,3.81; 12 8.89,3.81; 13 6.35,3.81; 14 3.81,3.81; 15 1.27,3.81; 16 -1.27,3.81; 17 -3.81,3.81; 18 -6.35,3.81; 19 -8.89,3.81; 20 -11.43,3.81
DIL16 = drill 0.813 long: 1 -8.89,-3.81; 2 -6.35,-3.81; 3 -3.81,-3.81; 4 -1.27,-3.81; 5 1.27,-3.81; 6 3.81,-3.81; 7 6.35,-3.81; 8 8.89,-3.81; 9 8.89,3.81; 10 6.35,3.81; 11 3.81,3.81; 12 1.27,3.81; 13 -1.27,3.81; 14 -3.81,3.81; 15 -6.35,3.81; 16 -8.89,3.81
DIL14 = drill 0.813 long: 1 -7.62,-3.81; 2 -5.08,-3.81; 3 -2.54,-3.81; 4 0,-3.81; 5 2.54,-3.81; 6 5.08,-3.81; 7 7.62,-3.81; 8 7.62,3.81; 9 5.08,3.81; 10 2.54,3.81; 11 0,3.81; 12 -2.54,3.81; 13 -5.08,3.81; 14 -7.62,3.81
1X08 = drill 1.016 long: 1 -8.89,0; 2 -6.35,0; 3 -3.81,0; 4 -1.27,0; 5 1.27,0; 6 3.81,0; 7 6.35,0; 8 8.89,0
1X10 = drill 1.016 long: 1 -11.43,0; 2 -8.89,0; 3 -6.35,0; 4 -3.81,0; 5 -1.27,0; 6 1.27,0; 7 3.81,0; 8 6.35,0; 9 8.89,0; 10 11.43,0
2X03 = drill 1.016 octagon: 1 -2.54,-1.27; 2 -2.54,1.27; 3 0,-1.27; 4 0,1.27; 5 2.54,-1.27; 6 2.54,1.27
2X02 = drill 1.016 octagon: 1 -1.27,-1.27; 2 -1.27,1.27; 3 1.27,-1.27; 4 1.27,1.27
2X07 = drill 1.016 octagon: 1 -7.62,-1.27; 2 -7.62,1.27; 3 -5.08,-1.27; 4 -5.08,1.27; 5 -2.54,-1.27; 6 -2.54,1.27; 7 0,-1.27; 8 0,1.27; 9 2.54,-1.27; 10 2.54,1.27; 11 5.08,-1.27; 12 5.08,1.27; 13 7.62,-1.27; 14 7.62,1.27
1X02 = drill 1.016 long: 1 -1.27,0; 2 1.27,0
0204/7 = drill 0.813 octagon: 1 -3.81,0; 2 3.81,0
1X03 = drill 1.016 long: 1 -2.54,0; 2 0,0; 3 2.54,0

### Placement (x,y rotation side)
!HALT  148.59,52.07 0 top
ADR1  76.2,78.74 90 top
ADR2  76.2,46.99 90 top
ADR3  76.2,16.51 90 top
C1  22.86,64.77 180 top
C2  22.86,33.02 180 top
C3  22.86,3.81 180 top
C4  68.58,93.98 0 top
C5  68.58,57.15 0 top
C6  68.58,27.94 0 top
C7  95.25,58.42 0 top
C8  95.25,27.94 0 top
C9  105.41,64.77 0 top
C10  110.49,77.47 90 top
C11  115.57,60.96 0 top
C12  119.38,27.94 0 top
C13  86.36,93.98 270 top
C14  139.7,93.98 270 top
C15  142.24,63.5 270 top
C16  144.78,27.94 0 top
CTRL  12.7,77.47 90 top
DATA1  99.06,16.51 90 top
DATA2  12.7,16.51 90 top
DATA3  124.46,16.51 90 top
DATA4  147.32,16.51 90 top
DT  95.25,39.37 0 top
H1  148.59,3.81 0 top
H2  148.59,95.25 0 top
IC1  30.48,76.2 90 top
IC2  30.48,44.45 90 top
IC3  30.48,15.24 90 top
IC4  60.96,82.55 270 top
IC5  60.96,45.72 270 top
IC6  60.96,16.51 270 top
IC7  87.63,46.99 270 top
IC8  87.63,16.51 270 top
IC9  92.71,68.58 180 top
IC10  116.84,85.09 90 top
IC11  107.95,46.99 270 top
IC12  111.76,16.51 270 top
IC13  121.92,48.26 270 top
IC14  133.35,83.82 270 top
IC15  135.89,53.34 270 top
IC16  137.16,16.51 270 top
JP1  46.99,72.39 90 top
JP2  46.99,44.45 90 top
JP3  46.99,13.97 90 top
JP4  68.58,82.55 90 top
JP5  68.58,45.72 90 top
JP6  68.58,16.51 90 top
JP7  46.99,93.98 0 top
JP8  77.47,95.25 90 top
JP9  100.33,86.36 90 top
JPD  40.64,25.4 0 top
R1  144.78,55.88 270 top
STATE  147.32,77.47 90 top
STP  124.46,68.58 90 top

### Tracks (layer width: path | path; a pad name or v marks a point on that pad's centre or on a via)
!CLRTOGGL
  Top 0.254: JP9.11 IC10.10
!CONSEL  (via drill 0.61)
  Top 0.254: v115.19,88.9 113.79,90.3 100.2,90.3 JP9.12
  Bottom 0.254: IC10.5 117.73,86.36 v115.19,88.9 | IC11.5 104.14,48.64 99.82,52.96 99.82,57.4 95.12,62.1 95.12,71.25 IC9.4 94.11,72.39 94.11,86.49 JP9.12
!CPUOUT  (via drill 0.61)
  Top 0.254: v43.94,33.02 IC2.1 | v115.06,54.48 112.52,51.94 109.98,51.94 104.9,46.86 101.09,46.86 94.11,39.88 94.11,29.84 93.6,29.34 91.57,29.34 v90.42,30.48 | v39.88,78.49 39.88,77.6 v42.93,74.55
  Bottom 0.254: v43.94,33.02 44.58,33.02 45.78,34.23 | 45.78,34.23 45.97,34.42 48.77,34.42 50.55,36.2 53.85,36.2 55.37,34.67 55.37,33.91 56.64,32.64 68.71,32.64 69.85,33.78 77.98,33.78 IC8.1 85.22,26.54 88.77,26.54 89.28,27.05 89.28,27.94 90.42,29.08 v90.42,30.48 | IC13.5 118.11,46.1 119.89,47.88 119.89,53.72 119.13,54.48 v115.06,54.48 | JP7.1 44.45,85.72 39.88,81.15 v39.88,78.49 | v42.93,74.55 42.93,56.26 42.8,56.13 42.8,37.21 45.78,34.23
!DATA0ENA
  Top 0.254: JP3.10 JPD.2
!DTACK
  Top 0.254: IC11.9 96.52,38.1 DT.1
!IAC  (via drill 0.61)
  Top 0.254: v106.17,83.06 102.49,83.06 102.11,82.68 100.2,82.68 JP9.6
  Bottom 0.254: IC14.13 134.24,77.47 130.3,81.41 122.68,81.41 121.41,82.68 106.55,82.68 v106.17,83.06
!LATCHD0
  Top 0.254: IC8.11 97.16,5.08 103.76,11.68 103.76,30.99 108.2,35.43 108.2,42.16 IC11.15
!LATCHD8  (via drill 0.61)
  Top 0.254: IC11.17 111.76,50.42 107.19,45.85 107.19,35.18 102.49,30.48 102.49,11.18 97.54,6.22 87.12,6.22 84.84,3.94 77.98,3.94 71.63,10.29 v70.87,10.29 | v59.44,27.81 57.4,29.84 35.31,29.84 28.96,36.2 28.96,53.98 27.05,55.88 IC2.11
  Bottom 0.254: v70.87,10.29 69.6,11.56 63.75,11.56 59.44,15.88 v59.44,27.81
!LDSB  (via drill 0.61)
  Top 0.254: IC11.16 111.76,47.88 116.33,43.31 116.33,40.26 117.86,38.73 128.27,38.73 v129.41,39.88 | JP1.4 48.64,71.12 63.75,56.01 71.25,56.01 75.06,59.82 94.36,59.82 v96.52,61.98
  Bottom 0.254: v129.41,39.88 129.41,49.4 IC15.6 | v96.52,61.98 96.52,61.47 102.36,55.63 102.36,55.5 103.38,54.48 105.54,54.48 IC11.16
!RDSWR00
  Bottom 0.254: IC10.15 112.01,78.74 110.87,79.88 100.2,79.88 JP9.2
!RDSWR08
  Bottom 0.254: IC10.14 106.68,81.28 JP9.7
!RDSWR16
  Top 0.254: IC10.13 108.97,83.82 103.89,78.74 JP9.1
!RDSWR24
  Top 0.254: IC10.12 110.74,86.36 105.66,81.28 JP9.3
!RDTOGGL
  Top 0.254: JP9.9 IC10.11
!RESET  (via drill 0.61)
  Top 0.254: IC15.11 139.7,42.29 141.48,44.07 141.48,47.37 140.72,48.13 130.3,48.13 126.75,44.58 124.33,44.58 v122.94,45.97 | v121.28,47.62 IC13.3 118.24,50.8 120.65,53.21 120.65,68.07 122.43,69.85 122.43,84.2 121.67,84.96 119.89,84.96 118.62,86.23 v118.62,89.53
  Bottom 0.254: v121.28,47.62 v122.94,45.97 | JP9.13 110.87,93.98 112.27,92.58 115.57,92.58 v118.62,89.53
!SELCPUDAT
  Top 0.254: IC13.1 118.11,58.17 115.44,60.83 115.44,73.15 114.94,73.66 114.94,82.3 117.73,85.09 117.73,89.92 119.25,91.44 IC10.7
!SELUSRDAT
  Top 0.254: IC10.9 118.49,93.98 119.63,95.12 121.67,95.12 127.51,89.28 127.51,47.88 126.49,46.86 122.05,46.86 121.67,46.48 119.89,46.48 IC13.4
!SUP
  Bottom 0.254: IC14.17 131.7,87.63 130.56,88.77 122.68,88.77 121.67,87.76 117.6,87.76 115.32,90.04 100.2,90.04 JP9.10
!UDSB  (via drill 0.61)
  Top 0.254: IC11.13 115.19,40.64 117.6,38.23 129.03,38.23 130.3,39.5 v130.3,40.89 | v77.98,92.58 79.12,92.58 81.03,90.68 84.96,90.68 101.47,74.17 101.98,74.17 108.58,67.56 v108.58,54.36
  Bottom 0.254: v130.3,40.89 130.3,45.21 IC15.8 | JP1.3 45.09,70.48 45.09,81.79 53.59,90.3 61.47,90.3 63.75,92.58 v77.98,92.58 | v108.58,54.36 111,51.94 112.78,51.94 115.57,49.15 115.57,39.75 122.05,33.27 122.05,32.51 121.54,32 120.4,32 IC11.13
!USR
  Bottom 0.254: IC14.15 131.7,82.55 130.3,83.95 122.68,83.95 121.41,85.22 104.39,85.22 102.11,87.5 100.2,87.5 JP9.8
!USROUT  (via drill 0.61)
  Top 0.254: IC5.1 57.15,56.77 62.99,50.93 62.99,37.97 57.02,32 v56.01,32 | IC4.1 57.15,93.6 62.87,87.88 v62.87,77.22 | v75.44,61.59 v83.19,61.59 | IC16.1 133.73,27.94 136.91,24.77 136.91,5.71 132.59,1.4 36.7,1.4 IC3.1
  Bottom 0.254: IC12.1 113.41,27.94 114.55,26.8 123.32,26.8 | 123.32,26.8 132.21,26.8 IC16.1 | IC13.6 118.11,42.8 123.32,37.59 123.32,26.8 | IC3.1 34.29,4.19 43.56,13.46 43.56,21.84 45.97,24.26 50.04,24.26 53.72,27.94 56.01,27.94 | 56.01,27.94 v56.01,32 | 56.01,27.94 IC6.1 | v62.87,77.22 62.87,73.41 64.01,72.26 66.17,72.26 68.83,69.6 68.83,68.33 68.77,68.26 | 68.77,68.26 57.66,57.15 IC5.1 | IC7.1 83.82,60.96 v83.19,61.59 | 68.77,68.26 v75.44,61.59
!VPAB  (via drill 0.61)
  Top 0.254: v103.89,69.72 102.49,69.72 102.11,70.1 89.15,70.1 88.01,68.96 83.31,68.96 82.17,70.1 67.94,70.1 65.53,72.52 60.45,72.52 57.91,75.06 54.86,75.06 48.64,81.28 JP1.8
  Bottom 0.254: IC15.4 132.08,57.53 133.86,59.31 133.86,70.23 130.3,73.79 119.76,73.79 119.25,74.3 118.49,74.3 113.03,68.83 104.78,68.83 v103.89,69.72
!WRCTRLED  (via drill 0.61)
  Top 0.254: v48.26,96.9 70.87,96.9 77.6,90.17 83.44,90.17 100.2,73.41 100.2,71.37 99.44,70.61 88.39,70.61 v87.63,69.85
  Bottom 0.254: IC1.11 32.13,87.63 41.4,96.9 v48.26,96.9 | v87.63,69.85 87.63,66.04 IC9.11
!WRUSRA00
  Top 0.254: IC9.10 85.98,64.77 82.42,68.33 67.56,68.33 IC4.11
!WRUSRA08
  Bottom 0.254: IC5.11 64.77,34.67 61.21,38.23 61.21,50.67 64.01,53.47 65.79,53.47 66.67,54.36 66.67,55.12 67.56,56.01 75.06,56.01 IC9.9
!WRUSRA16  (via drill 0.61)
  Top 0.254: v87,29.34 v87,16.26
  Bottom 0.254: IC6.11 74.04,5.08 83.06,14.1 84.84,14.1 v87,16.26 | v87,29.34 87.88,30.23 87.88,61.59 90.04,63.75 90.04,68.71 IC9.7
!WRUSRD00
  Top 0.254: IC7.11 91.44,35.94 93.6,38.1 93.6,42.29 98.3,46.99 98.3,60.96 99.44,62.1 99.44,64.39 IC9.15
!WRUSRD08  (via drill 0.61)
  Top 0.254: IC3.11 26.42,26.67 20.45,32.64 20.45,44.2 25.91,49.66 27.69,49.66 28.45,50.42 28.45,53.72 27.43,54.74 25.65,54.74 24.89,55.5 24.89,56.26 25.65,57.02 42.67,57.02 v44.2,55.5 | v77.22,60.71 92.46,60.71 IC9.14
  Bottom 0.254: v44.2,55.5 44.96,55.5 45.72,54.74 55.12,54.74 56.39,56.01 60.71,56.01 65.41,60.71 v77.22,60.71
!WRUSRD16  (via drill 0.61)
  Top 0.254: IC12.11 126.11,5.08 132.59,11.56 134.37,11.56 135.51,12.7 v135.51,13.97 | v106.81,63.25 106.43,63.63 106.3,63.63 105.28,64.64 105.28,65.41 101.6,69.09 95.12,69.09 93.34,67.31 93.34,65.41 IC9.13
  Bottom 0.254: v135.51,13.97 135.51,28.45 120.4,43.56 120.4,55.75 118.87,57.28 109.98,57.28 106.81,60.45 v106.81,63.25
!WRUSRD24  (via drill 0.61)
  Top 0.254: v121.16,32.89 130.56,32.89 138.68,24.77 138.68,7.37 IC16.11
  Bottom 0.254: IC9.12 91.69,64.77 99.31,57.15 99.31,52.07 102.36,49.02 102.36,47.88 103.38,46.86 105.92,46.86 111,41.78 112.78,41.78 121.16,33.4 v121.16,32.89
A1B  (via drill 0.61)
  Top 0.254: v118.87,73.41 118.87,74.42 IC10.1 | JP7.6 55.5,95.25 55.88,95.63 58.42,95.63 64.01,90.04 74.68,90.04 77.98,86.74 v80.9,86.74
  Bottom 0.254: IC9.1 112.65,72.39 115.19,74.93 117.6,74.93 118.87,76.2 IC10.1 122.43,77.98 122.43,79.12 121.67,79.88 112.27,79.88 111.76,80.39 106.81,80.39 102.23,84.96 98.81,84.96 97.92,85.85 97.92,89.41 98.55,90.04 99.31,90.04 100.2,90.93 100.2,91.95 99.57,92.58 98.55,92.58 92.71,86.74 v80.9,86.74 | IC11.1 104.14,63.25 105.54,64.64 105.54,65.15 108.71,68.33 113.79,68.33 v118.87,73.41
A2B
  Top 0.254: JP7.4 47.88,95.25 49.02,96.39 70.61,96.39 77.34,89.66 81.79,89.66 IC9.2
  Bottom 0.254: IC11.2 104.14,56.26 102.36,58.04 102.36,63.37 102.74,63.75 102.74,65.79 101.22,67.31 100.84,67.31 99.06,69.09 IC9.2 100.84,74.17 113.16,74.17 114.43,75.44 116.08,75.44 119.38,78.74 IC10.2
A3B  (via drill 0.61)
  Top 0.254: IC11.3 104.14,53.72 101.09,56.77 v101.09,58.67 | v116.71,77.34 IC10.3 | JP7.2 45.34,95.25 46.48,94.11 55.12,94.11 56.13,95.12 58.17,95.12 62.99,90.3 62.99,88.52 64.01,87.5 75.44,87.5 78.61,84.33 78.61,75.69 77.72,74.8 76.96,74.8 76.33,74.17 76.33,73.15 76.96,72.52 81.79,72.52 83.44,74.17 94.74,74.17 IC9.3
  Bottom 0.254: v101.09,58.67 97.66,62.1 97.66,71.25 IC9.3 96.77,72.26 101.85,77.34 v116.71,77.34
A4B  (via drill 0.61)
  Top 0.254: v94.23,66.93 99.06,66.93 99.5,66.48 | 99.5,66.48 100.2,65.79 100.2,54.74 IC11.4 | IC10.4 120.65,83.44 115.82,78.61 v115.82,74.04 | 99.5,66.48 v101.22,68.2 | JP7.5 53.72,92.71 56.39,90.04 58.17,90.04 61.98,86.23 61.98,76.83 64.01,74.8 65.79,74.8 66.67,73.91 66.67,73.15 69.22,70.61 87.12,70.61 IC9.6
  Bottom 0.254: IC9.6 94.23,67.06 v94.23,66.93 | v115.82,74.04 115.06,74.04 111.63,70.61 103.5,70.61 101.22,68.33 v101.22,68.2
D0B  (via drill 0.61)
  Top 0.254: v74.8,58.29 81.41,58.29 IC7.2 83.69,55.88 83.69,55.37 79.63,51.31 79.63,43.56 78.61,42.55 78.61,41.27 v70.23,32.89 | IC5.2 57.15,54.99 49.28,62.87 v49.28,66.17 | IC16.2 v131.06,23.11 | IC3.2 45.72,6.35 JP3.2 | v60.33,24.26 58.29,24.26 IC6.2 | v100.71,33.66 95.12,28.07 95.12,27.56 94.23,26.67 v92.96,26.67
  Bottom 0.254: IC5.2 60.07,54.61 63.75,58.29 v74.8,58.29 | IC1.2 35.69,67.31 38.1,64.9 41.4,64.9 41.91,65.41 41.91,66.17 40.89,67.18 40.89,74.3 42.74,76.14 | 42.74,76.14 44.58,77.98 44.58,82.04 48.77,86.23 48.77,90.17 49.4,90.81 56.52,90.81 IC4.2 | v49.28,66.17 48.01,67.44 45.72,67.44 43.81,69.34 43.81,75.06 42.74,76.14 | v131.06,23.11 130.94,23.24 123.19,23.24 121.67,21.72 106.93,21.72 106.17,22.48 106.17,23.24 107.95,25.02 IC12.2 107.95,25.78 100.71,33.02 v100.71,33.66 | IC6.2 51.94,25.4 48.01,21.46 45.72,21.46 44.58,20.32 44.58,7.49 JP3.2 | 70.99,25.4 IC8.2 88.39,25.4 89.66,26.67 v92.96,26.67 | 70.99,25.4 69.85,24.26 v60.33,24.26 | v70.23,32.89 70.23,29.08 70.99,28.32 70.99,25.4
D1B  (via drill 0.61)
  Top 0.254: v41.02,65.79 v52.96,53.85 | IC4.3 37.72,88.9 35.05,86.23 33.27,86.23 32,84.96 32,72.14 IC1.3 | IC3.3 45.72,8.89 JP3.3 46.99,7.75 50.55,11.3 57.91,11.3 58.93,12.32 58.93,15.62 58.17,16.38 56.39,16.38 55.37,17.4 55.37,20.7 57.15,22.48 IC6.3 57.15,22.35 57.78,21.72 v60.33,21.72 | 83.82,52.96 80.14,49.28 80.14,42.8 v79.5,42.16 | v79.5,35.69 79.5,34.92 83.69,30.73 83.69,29.97 82.04,28.32 82.04,24.64 IC8.3 | IC12.3 107.95,23.24 109.73,25.02 109.73,34.67 v109.09,35.31 | v95,49.4 92.46,51.94 88.77,51.94 87.38,50.55 86.23,50.55 83.82,52.96 | 83.82,52.96 IC7.3 | IC5.3 57.53,52.07 v62.1,47.5
  Bottom 0.254: IC5.3 54.74,52.07 v52.96,53.85 | v41.02,65.79 37.97,65.79 34.29,69.47 IC1.3 | IC12.3 113.41,22.86 114.55,24 132.21,24 IC16.3 | IC8.3 70.99,22.86 69.85,21.72 v60.33,21.72 | v79.5,35.69 79.5,40.77 | 79.5,40.77 v79.5,42.16 | v109.09,35.31 104.9,39.5 103.12,39.5 101.09,41.53 101.09,43.31 v95,49.4 | v62.1,47.5 62.1,42.42 63.75,40.77 79.5,40.77
D2B  (via drill 0.61)
  Top 0.254: v39.62,82.42 41.91,80.14 49.02,80.14 55.5,73.66 IC4.9 62.99,67.82 78.23,67.82 v84.45,61.59 | IC16.4 132.59,20.32 123.83,29.08 114.55,29.08 113.03,27.56 113.03,25.78 107.95,20.7 IC12.4 107.95,19.94 104.27,16.26 104.27,11.43 96.27,3.43 77.22,3.43 v74.17,6.48 | IC3.4 45.72,11.43 JP3.4 | IC5.9 54.99,36.83 v53.47,35.31 | v58.8,59.56 58.8,57.66 60.96,55.5 v60.96,54.23
  Bottom 0.254: v39.62,82.42 36.96,85.09 IC1.9 | IC7.4 83.82,51.18 85.6,52.96 85.6,60.45 v84.45,61.59 | JP3.4 47.62,10.16 50.16,7.62 IC6.9 58.29,6.48 65.53,6.48 66.04,5.97 73.66,5.97 v74.17,6.48 78.61,10.92 78.61,12.19 82.8,16.38 84.58,16.38 85.6,17.4 85.6,18.16 83.82,19.94 IC8.4 | v53.47,35.31 53.47,34.29 44.32,25.15 44.32,23.37 36.07,15.11 36.07,13.21 IC3.4 | IC4.9 57.15,73.28 58.93,71.5 58.93,59.69 v58.8,59.56 | v60.96,54.23 60.96,51.18 59.44,49.66 59.44,38.73 57.53,36.83 IC5.9
D3B  (via drill 0.61)
  Top 0.254: v118.62,9.78 128.27,9.78 132.59,14.1 134.37,14.1 135.13,14.86 135.13,16 IC16.5 | IC7.5 89.28,48.26 90.68,46.86 93.73,46.86 v93.85,46.74 | IC3.5 45.72,13.97 JP3.5 | v38.23,82.55 38.48,82.55 39.24,83.31 47.37,83.31 54.48,76.2 IC4.8 | v52.2,35.31 56.26,39.37 IC5.8 | IC12.5 107.95,17.4 104.78,14.22 104.78,11.18 96.52,2.92 76.33,2.92 v72.26,6.99
  Bottom 0.254: v118.62,9.78 117.09,11.3 114.81,11.3 108.33,17.78 IC12.5 105.66,20.07 105.66,26.54 99.82,32.38 99.82,41.66 94.74,46.74 v93.85,46.74 | JP3.5 49.53,10.16 IC6.8 58.29,9.02 65.53,9.02 66.55,8 66.55,7.24 67.31,6.48 71.63,6.48 72.2,7.05 | IC8.5 82.93,17.78 77.72,12.57 76.96,12.57 76.07,11.68 76.07,10.92 72.2,7.05 | IC5.8 57.15,39.75 48.9,48.01 48.9,51.31 48.01,52.2 45.72,52.2 43.31,54.61 43.31,55.88 55.37,67.94 55.37,74.42 IC4.8 | v38.23,82.55 IC1.8 | IC3.5 34.29,14.35 43.81,23.88 43.81,26.67 52.2,35.05 v52.2,35.31 | v72.26,6.99 72.2,7.05
D4B  (via drill 0.61)
  Top 0.254: IC1.4 34.29,72.77 32.51,74.55 32.51,82.93 33.53,83.95 38.35,83.95 40.77,86.36 IC4.4 | v113.41,9.78 113.79,9.78 114.55,9.02 116.59,9.02 118.24,10.67 122.3,10.67 122.68,10.29 128.02,10.29 132.97,15.24 IC16.6 | IC3.6 45.72,16.51 JP3.6 | 78.93,11.24 77.98,10.29 74.17,10.29 70.36,14.1 63.37,14.1 IC6.4 | 78.93,11.24 82.93,15.24 IC8.6 82.8,15.24 81.53,16.51 81.53,28.57 82.8,29.84 v82.8,30.35 | 78.93,11.24 v81.15,9.02 | v38.35,66.67 38.35,62.61 45.09,55.88 45.09,55.37 45.97,54.48 49.53,54.48 54.48,49.53 IC5.4
  Bottom 0.254: v113.41,9.78 IC12.6 108.08,14.99 104.65,11.56 104.65,8.51 104.14,8 93.22,8 92.2,9.02 v81.15,9.02 | IC7.6 83.82,45.34 86.11,43.05 86.11,33.66 v82.8,30.35 82.8,30.48 78.99,34.29 69.6,34.29 68.45,33.15 63.75,33.15 61.47,35.43 56.39,35.43 55.37,36.45 55.37,37.21 56.13,37.97 57.91,37.97 58.93,38.99 58.93,47.37 57.15,49.15 IC5.4 | JP3.6 52.07,15.24 IC6.4 | IC1.4 34.29,72.01 38.35,67.94 v38.35,66.67
D5B  (via drill 0.61)
  Top 0.254: IC3.7 45.72,19.05 JP3.7 | v85.22,34.16 85.6,33.78 85.6,14.86 83.82,13.08 IC8.7 82.04,10.92 82.04,7.24 82.8,6.48 v85.47,6.48 | 57.15,46.61 62.1,41.66 v62.1,39.88 | v39.5,68.58 55.37,52.7 55.37,51.69 56.39,50.67 58.17,50.67 58.93,49.91 58.93,48.77 IC5.5 57.15,46.61 | IC4.5 48.39,83.82 47.5,84.71 v44.7,84.71 | v38.99,76.33 35.69,76.33 IC1.5 | v41.91,38.99 45.47,38.99 45.97,39.5 50.04,39.5 57.15,46.61
  Bottom 0.254: IC12.7 107.95,12.32 106.17,10.54 106.17,7.24 106.24,7.18 | 106.24,7.18 107.19,6.22 111.12,6.22 113.92,3.43 124.08,3.43 IC16.7 | IC6.5 57.15,18.16 58.93,19.94 58.93,20.7 58.17,21.46 50.67,21.46 JP3.7 | 85.22,34.42 85.22,34.8 85.6,35.18 85.6,41.4 IC7.7 | v62.1,39.88 64.01,37.97 75.95,37.97 79.12,34.8 82.42,34.8 82.8,34.42 85.22,34.42 | 85.22,34.42 v85.22,34.16 | IC1.5 34.29,74.55 39.5,69.34 v39.5,68.58 | v44.7,84.71 44.7,84.2 40.77,80.26 40.77,78.11 v38.99,76.33 | IC3.7 34.29,19.43 38.23,23.37 38.23,31.5 41.91,35.18 v41.91,38.99 | v85.47,6.48 92.46,6.48 93.09,7.11 106.17,7.11 106.24,7.18
D6B  (via drill 0.61)
  Top 0.254: v103.76,8.89 106.68,8.89 IC12.8 | IC7.8 84.71,40.64 89.66,35.69 89.66,33.78 v93.22,30.23 | IC4.7 52.7,78.74 47.62,83.82 38.99,83.82 38.61,83.44 37.72,83.44 IC1.7 | IC3.8 45.72,21.59 JP3.8 54.61,12.7 IC6.7 | IC5.7 57.15,41.53 v50.93,35.31 | v40.01,66.67 40.01,65.28 v54.86,50.42
  Bottom 0.254: 90.36,11.24 90.42,11.3 95.5,11.3 97.92,8.89 v103.76,8.89 | 90.36,11.24 89.28,10.16 IC8.8 79.88,10.16 73.66,3.94 53.09,3.94 48.01,9.02 45.72,9.02 45.09,9.65 45.09,18.41 JP3.8 | v93.22,30.23 95.12,28.32 95.12,26.92 92.2,24 90.42,24 88.65,22.23 88.65,12.95 90.36,11.24 | IC16.8 133.35,10.54 135.13,12.32 135.13,13.08 134.37,13.84 130.56,13.84 120.65,3.94 114.17,3.94 IC12.8 | v50.93,35.31 50.93,34.54 43.05,26.67 43.05,24.13 36.83,17.91 33.27,17.91 32.51,18.67 32.51,19.81 IC3.8 | IC1.7 34.29,79.63 40.39,73.53 40.39,67.06 v40.01,66.67 | v54.86,50.42 54.86,44.2 IC5.7
D7B  (via drill 0.61)
  Top 0.254: IC12.9 107.95,7.24 106.17,5.46 106.17,4.7 106.24,4.64 | 106.24,4.64 106.93,3.94 129.67,3.94 IC16.9 | IC8.9 83.82,8 86.11,10.29 86.11,35.81 IC7.9 | v104.78,3.17 106.24,4.64 | IC1.6 37.59,77.47 38.42,78.3 | 38.42,78.3 39.5,79.38 43.94,79.38 45.72,77.6 49.02,77.6 v49.66,78.23 | IC6.6 54.61,15.24 JP3.9 39.5,22.86 38.23,24.13 IC3.9 | IC5.6 55.75,44.45 48.01,36.7 41.27,36.7 v41.02,36.45 | 38.42,78.3 41.78,74.93 v41.78,73.41
  Bottom 0.254: v104.78,3.17 83.57,3.17 82.11,4.64 | 82.11,4.64 82.04,4.7 82.04,5.84 IC8.9 | v49.66,78.23 54.1,78.23 IC4.6 | IC3.9 36.07,25.91 36.07,30.1 41.02,35.05 v41.02,36.45 41.02,55.12 42.42,56.52 42.42,66.42 41.78,67.06 v41.78,73.41 | JP3.9 46.35,22.86 44.07,20.57 44.07,5.59 45.72,3.94 48.01,3.94 48.51,3.43 73.91,3.43 75.06,4.57 82.04,4.57 82.11,4.64
D8B
  Top 0.254: JP2.2 IC2.2
D9B
  Top 0.254: JP2.3 IC2.3
D10B
  Top 0.254: JP2.4 IC2.4
D11B
  Top 0.254: JP2.5 IC2.5
D12B
  Top 0.254: JP2.6 IC2.6
D13B
  Top 0.254: JP2.7 IC2.7
D14B
  Top 0.254: JP2.8 IC2.8
D15B
  Top 0.254: JP2.9 IC2.9
DATA0DIR  (via drill 0.61)
  Top 0.254: IC11.19 111.38,55.88 105.16,49.66 v99.19,49.66 | v97.41,49.66 97.41,46.86 92.33,41.78 80.39,41.78 69.72,31.11 48.9,31.11 JP2.1
  Bottom 0.254: v97.41,49.66 v99.19,49.66
FC0B
  Bottom 0.254: IC14.2 116.46,92.71 114.05,95.12 88.01,95.12 86.87,93.98 80.64,93.98 76.71,90.04 62.99,90.04 57.91,84.96 53.21,84.96 JP1.7
FC1B  (via drill 0.61)
  Top 0.254: v105.16,69.72 104.27,68.83 102.62,68.83 101.85,69.6 89.41,69.6 88.27,68.45 83.06,68.45 82.3,69.22 v67.94,69.22
  Bottom 0.254: IC14.8 124.08,77.47 121.41,74.8 118.24,74.8 113.16,69.72 v105.16,69.72 | v67.94,69.22 64.52,69.22 58.93,74.8 58.93,76.58 58.17,77.34 48.13,77.34 JP1.6
FC2B  (via drill 0.61)
  Top 0.254: v19.05,41.53 19.05,51.69 33.53,66.17 35.81,66.17 41.4,71.75 45.09,71.75 JP1.5
  Bottom 0.254: IC14.11 137.16,66.8 134.37,64.01 134.37,54.74 132.84,53.21 131.06,53.21 128.52,50.67 128.52,36.2 136.4,28.32 136.4,5.97 131.83,1.4 34.54,1.4 29.97,5.97 29.97,44.58 27.69,46.86 24.38,46.86 v19.05,41.53
GND  (via drill 0.61)
  Top 0.508: CTRL.5 13.97,76.83 12.7,75.56 12.7,71.75 19.68,64.77 C1.2 | DATA2.6 10.16,15.24 10.16,13.34 10.79,12.7 12.06,12.7 12.7,12.06 12.7,10.79 19.68,3.81 C3.2 21.72,3.68 22.48,3.68 23.62,2.54 27.81,2.54 31.75,6.48 | JPD.1 38.1,26.67 IC3.10 32.38,24.77 32.38,7.11 31.75,6.48 | C6.2 69.22,27.94 66.67,30.48 46.86,30.48 45.47,31.88 | 45.47,31.88 44.96,32.38 44.96,33.66 45.59,34.29 IC5.10 | v45.34,31.75 45.47,31.88 | C5.2 69.85,58.42 IC4.10 | JP8.1 80.01,92.71 C13.- 115.57,92.71 117.47,90.81 | ADR3.5 ADR3.6 | 71.63,11.43 72.01,11.43 78.36,5.08 IC8.10 | 71.63,11.43 63.5,11.43 IC6.10 55.88,3.81 45.59,3.81 44.32,5.08 33.15,5.08 31.75,6.48 | v71.63,11.56 71.63,11.43 | C14.2 IC14.19 134.62,95.25 IC14.1 | C10.2 110.49,81.15 111.89,82.55 114.17,82.55 117.09,85.47 117.09,90.42 117.47,90.81 | IC10.8 117.47,90.81 | DATA1.5 99.06,16.51 | 99.06,16.51 DATA1.6 | IC11.10 C8.2 95.63,27.05 95.63,24.64 97.03,23.24 98.04,23.24 99.06,22.23 99.06,16.51 | IC15.19 C15.2 142.37,62.36 143,62.36 150.37,69.72 150.37,75.82 149.48,76.71 149.35,76.71 STATE.7 148.46,77.34 147.83,77.34 146.69,76.2 143.51,76.2 IC15.1 | DATA4.5 DATA4.6 | DATA3.5 124.46,16.51 | 124.46,16.51 DATA3.6 | C11.2 116.84,60.45 120.02,57.28 120.02,55.24 IC13.2 | IC13.7 119.38,39.37 126.87,39.37 129.41,41.91 IC15.10 132.21,42.04 146.05,28.19 C16.2 | 124.46,16.51 124.46,19.68 123.83,20.32 120.52,20.32 116.71,24.13 114.43,24.13 | 114.43,24.13 113.67,24.89 113.67,25.91 114.43,26.67 119.38,26.67 C12.2 | IC12.10 112.39,9.53 112.39,22.1 114.43,24.13
  Bottom 0.508: CTRL.5 CTRL.6 | 34.29,63.5 IC1.1 32.38,66.67 32.38,85.72 IC1.10 | 34.29,63.5 IC2.10 32.38,53.98 32.38,28.57 IC3.10 | C1.2 22.35,64.77 23.62,63.5 34.29,63.5 | C2.2 21.59,24.13 DATA2.5 DATA2.6 | JPD.1 39.37,25.78 v45.34,31.75 | IC7.10 80.52,38.86 80.52,43.94 ADR2.5 | ADR2.5 ADR2.6 | ADR1.5 IC9.8 85.09,71.12 85.09,66.67 | ADR1.5 ADR1.6 | C4.2 74.3,93.98 75.56,95.25 77.47,95.25 | JP8.3 77.47,95.25 | 77.47,95.25 JP8.1 | C13.- 85.34,92.71 79.88,87.25 79.88,81.79 77.6,79.5 77.6,78.87 ADR1.5 | 85.09,66.67 85.09,63.63 84.33,62.87 82.93,62.87 81.92,61.85 81.92,52.07 77.6,47.75 77.6,47.12 ADR2.5 | C5.2 75.18,57.15 82.55,64.52 82.55,65.91 83.31,66.67 85.09,66.67 | IC8.10 85.09,3.81 92.58,3.81 93.85,5.08 IC12.10 110.24,2.79 124.46,2.79 126.75,5.08 IC16.10 | ADR3.6 74.93,15.88 71.63,12.57 v71.63,11.56 | IC14.1 121.92,95.25 IC10.8 | C16.2 146.05,26.04 149.86,22.23 149.86,17.78 DATA4.5 | 129.54,69.85 129.54,67.31 IC15.1 | 129.54,69.85 IC14.10 | IC13.2 116.2,51.44 116.2,42.55 IC13.7 122.68,36.07 122.68,32.13 120.65,30.1 | 120.65,30.1 C12.2 | C7.2 96.52,53.85 101.73,48.64 101.73,45.72 103,44.45 105.28,44.45 109.86,39.88 109.86,37.59 110.62,36.83 113.92,36.83 114.68,36.07 | 120.65,30.1 114.68,36.07 | C9.2 113.03,64.77 115.44,62.36 | C11.2 115.44,62.36 | 129.54,69.85 122.94,69.85 115.44,62.36 | IC11.10 107.31,35.56 108.58,34.29 112.9,34.29 114.68,36.07 | C14.2 142.88,92.71 149.86,85.72 149.86,78.74 STATE.7
LA00
  Top 0.254: IC4.19 JP4.8 74.04,91.44 76.33,89.15 79.76,89.15 81.79,87.12 81.79,77.98 ADR1.1
LA01
  Top 0.254: JP4.7 IC4.18
  Bottom 0.254: ADR1.2 74.93,74.55 70.48,78.99 70.48,79.25 69.6,80.14 67.31,80.14 66.55,80.9 66.55,87.12 IC4.18
LA02
  Top 0.254: ADR1.3 76.58,76.2 75.18,74.8 69.72,74.8 JP4.1
  Bottom 0.254: JP4.1 IC4.12
LA03
  Top 0.254: IC4.13 JP4.2 ADR1.4
LA04
  Top 0.254: IC4.17 JP4.6 74.04,86.36 76.07,84.33 76.07,83.31 74.93,82.17 ADR1.8
LA05
  Top 0.254: JP4.5 IC4.16
  Bottom 0.254: ADR1.7 77.47,82.17 78.61,83.31 78.61,84.33 77.98,84.96 69.72,84.96 JP4.5
LA06
  Top 0.254: IC4.14 JP4.3 73.66,83.82 ADR1.10
LA07
  Top 0.254: JP4.4 IC4.15
  Bottom 0.254: ADR1.9 76.58,83.82 75.18,82.42 69.72,82.42 JP4.4
LA08
  Top 0.254: IC5.19 JP5.8 76.58,54.61 79.12,52.07 79.12,44.45 77.47,42.8 ADR2.1
LA09
  Top 0.254: JP5.7 IC5.18
  Bottom 0.254: ADR2.2 74.93,42.8 70.48,47.24 70.48,50.16 JP5.7
LA10
  Top 0.254: IC5.12 JP5.1 70.48,38.73 70.48,39.12 74.42,43.05 75.18,43.05 76.58,44.45 ADR2.3
LA11
  Top 0.254: IC5.13 JP5.2 73.66,44.45 ADR2.4
LA12
  Top 0.254: IC5.17 JP5.6 ADR2.8
LA13
  Top 0.254: IC5.16 JP5.5 69.72,48.13 75.18,48.13 76.58,49.53 ADR2.7
LA14
  Top 0.254: JP5.3 IC5.14
  Bottom 0.254: ADR2.10 70.99,52.07 69.85,53.21 67.31,53.21 66.55,52.45 66.55,43.69 IC5.14
LA15
  Top 0.254: IC5.15 JP5.4 69.72,45.59 75.18,45.59 76.07,46.48 76.07,47.24 76.96,48.13 77.72,48.13 78.61,49.02 78.61,50.04 77.47,51.18 ADR2.9
LA16
  Top 0.254: IC6.19 JP6.8 73.53,20.45 77.72,20.45 78.61,19.56 78.61,13.46 77.47,12.32 ADR3.1
LA17
  Top 0.254: JP6.7 IC6.18 62.99,21.08 62.99,17.4 63.75,16.64 69.72,16.64 ADR3.2
LA18
  Top 0.254: JP6.1 IC6.12
  Bottom 0.254: ADR3.4 72.52,11.56 72.52,10.67 69.47,7.62 JP6.1
LA19  (via drill 0.61)
  Top 0.254: IC6.13 JP6.2 69.98,8.76 v71.88,8.76
  Bottom 0.254: ADR3.3 76.58,13.97 75.18,12.57 74.42,12.57 73.03,11.18 73.03,9.91 v71.88,8.76
LA20
  Top 0.254: IC6.17 JP6.6 69.85,19.05 ADR3.8
LA21
  Top 0.254: IC6.16 JP6.5 75.31,17.78 76.58,19.05 ADR3.7
LA22
  Top 0.254: JP6.3 IC6.14
  Bottom 0.254: ADR3.10 69.72,16.38 67.31,16.38 66.55,15.62 66.55,14.48 IC6.14
LA23
  Top 0.254: JP6.4 IC6.15
  Bottom 0.254: ADR3.9 76.58,21.59 75.18,20.19 74.3,20.19 69.34,15.24 JP6.4
LAR
  Top 0.254: IC1.13 16.51,82.55 CTRL.7
LCON
  Bottom 0.254: IC1.15 19.05,77.47 CTRL.9
LD00  (via drill 0.61)
  Top 0.254: v93.85,12.7 93.85,22.61 91.44,25.02 IC8.19 89.66,27.18 89.66,27.94 v87,30.61 | v87,51.44 IC7.19
  Bottom 0.254: v93.85,12.7 94.87,12.7 97.28,10.29 99.19,10.29 DATA1.1 | v87,30.61 v87,51.44
LD01  (via drill 0.61)
  Top 0.254: v96.65,25.15 98.68,25.15 98.74,25.08 | 98.74,25.08 101.98,21.84 101.98,11.43 100.84,10.29 98.93,10.29 DATA1.2 | v101.98,43.69 101.98,40.64 103.38,39.24 105.16,39.24 105.92,38.48 105.92,34.67 98.81,27.56 98.81,25.15 98.74,25.08
  Bottom 0.254: IC8.18 94.36,22.86 v96.65,25.15 | IC7.18 91.44,53.72 89.66,55.5 89.66,58.8 90.42,59.56 94.36,59.56 95.38,58.55 95.38,50.29 v101.98,43.69
LD02  (via drill 0.61)
  Top 0.254: IC8.17 91.44,19.94 93.22,18.16 93.22,14.86 92.2,13.84 90.42,13.84 89.66,13.08 89.66,9.78 90.42,9.02 92.46,9.02 96.65,13.21 96.65,14.48 97.28,15.11 99.19,15.11 DATA1.3 | IC7.17 91.44,50.42 94.74,47.12 v94.74,45.47
  Bottom 0.254: v94.74,45.47 94.74,42.8 99.31,38.23 99.31,32.13 101.47,29.97 101.47,15.11 DATA1.3
LD03  (via drill 0.61)
  Top 0.254: v88.39,27.43 88.39,20.83 IC8.16
  Bottom 0.254: IC8.16 91.44,17.4 89.66,15.62 89.66,14.86 90.42,14.1 97.66,14.1 DATA1.4 | IC7.16 90.55,48.26 88.39,46.1 v88.39,27.43
LD04
  Bottom 0.254: IC8.15 93.98,15.24 DATA1.8 98.93,20.19 98.93,21.84 99.69,22.61 99.69,30.99 98.81,31.88 98.81,37.97 91.44,45.34 IC7.15
LD05
  Bottom 0.254: DATA1.7 99.19,17.91 99.19,13.72 98.3,12.83 97.28,12.83 96.52,13.59 93.47,13.59 92.58,12.7 IC8.14 91.06,12.7 89.15,14.61 89.15,17.65 90.42,18.92 92.2,18.92 93.22,19.94 93.22,20.45 97.66,24.89 97.66,28.32 96.9,29.08 95.76,29.08 89.66,35.18 89.66,41.02 91.44,42.8 IC7.14
LD06
  Top 0.254: IC8.13 92.58,10.16 96.14,13.72 96.14,19.94 DATA1.10
  Bottom 0.254: IC7.13 91.44,40.26 98.3,33.4 98.3,31.62 99.19,30.73 99.19,22.99 DATA1.10
LD07  (via drill 0.61)
  Top 0.254: IC8.12 92.33,7.62 97.54,12.83 100.84,12.83 101.47,13.46 101.47,20.45 DATA1.9 100.33,21.97 98.3,24 v98.3,24.26
  Bottom 0.254: IC7.12 91.44,37.72 98.3,30.86 v98.3,24.26
LD08
  Top 0.254: IC3.19 19.05,6.35 DATA2.1
  Bottom 0.254: IC2.19 25.15,35.56 22.73,33.15 22.73,20.19 DATA2.1
LD09
  Bottom 0.254: 24.89,8.89 13.97,8.89 DATA2.2 | 24.89,8.89 IC3.18 | IC2.18 26.67,37.72 28.45,35.94 28.45,30.61 24.89,27.05 24.89,8.89
LD10
  Top 0.254: IC3.17 16.51,11.43 DATA2.3
  Bottom 0.254: IC2.17 27.05,40.64 29.46,38.23 29.46,14.22 IC3.17
LD11
  Top 0.254: IC3.16 15.62,13.97 14.48,15.11 12.57,15.11 DATA2.4
  Bottom 0.254: IC2.16 26.67,42.8 24.89,41.02 24.89,40.26 25.91,39.24 27.69,39.24 28.96,37.97 28.96,16.26 IC3.16
LD12
  Top 0.254: IC3.15 15.62,16.51 14.22,17.91 12.57,17.91 DATA2.8
  Bottom 0.254: IC2.15 26.67,45.34 12.57,31.24 12.57,20.19 DATA2.8
LD13
  Top 0.254: DATA2.7 IC3.14 28.45,20.83 28.45,27.05 22.99,32.51 22.99,44.2 26.67,47.88 IC2.14
LD14
  Top 0.254: IC3.13 15.62,21.59 14.48,20.45 12.57,20.45 DATA2.10
  Bottom 0.254: IC2.13 26.67,50.42 11.43,35.18 DATA2.10
LD15
  Top 0.254: 19.94,24.13 16.51,24.13 DATA2.9 | 19.94,24.13 IC3.12 | IC2.12 26.67,52.96 19.94,46.23 19.94,24.13
LD16
  Top 0.254: IC12.19 121.03,25.4 124.59,21.84 124.59,21.08 125.48,20.19 126.24,20.19 127.38,19.05 127.38,13.08 DATA3.1
LD17
  Top 0.254: IC12.18 115.57,22.48 113.79,20.7 113.79,12.32 114.68,11.43 DATA3.2
LD18
  Bottom 0.254: IC12.17 117.73,20.32 122.94,15.11 124.59,15.11 DATA3.3
LD19
  Bottom 0.254: IC12.16 119.38,17.78 DATA3.4
LD20
  Top 0.254: IC12.15 119.38,15.24 DATA3.8
LD21
  Top 0.254: IC12.14 120.27,12.7 122.94,15.37 126.24,15.37 126.87,16 126.87,17.91 DATA3.7
LD22
  Bottom 0.254: IC12.13 115.57,9.78 113.79,8 113.79,7.24 114.55,6.48 122.43,6.48 127.38,11.43 127.38,21.59 126.24,22.73 124.33,22.73 DATA3.10
LD23
  Bottom 0.254: IC12.12 117.73,7.62 122.94,12.83 126.24,12.83 126.87,13.46 126.87,20.45 DATA3.9
LD24
  Bottom 0.254: IC16.19 140.97,25.02 145.8,20.19 146.56,20.19 147.45,19.3 147.45,16 148.34,15.11 149.1,15.11 149.73,14.48 149.73,12.57 DATA4.1
LD25
  Bottom 0.254: IC16.18 140.97,22.48 139.19,20.7 139.19,17.4 140.21,16.38 141.99,16.38 146.05,12.32 DATA4.2
LD26
  Bottom 0.254: IC16.17 140.97,19.94 145.8,15.11 147.45,15.11 DATA4.3
LD27
  Bottom 0.254: IC16.16 142.24,17.78 DATA4.4
LD28
  Top 0.254: IC16.15 142.24,15.24 DATA4.8
LD29
  Top 0.254: IC16.14 140.97,13.08 145.8,17.91 147.45,17.91 DATA4.7
LD30
  Top 0.254: IC16.13 140.97,10.54 139.19,12.32 139.19,15.62 140.21,16.64 141.99,16.64 146.05,20.7 DATA4.10
LD31
  Top 0.254: IC16.12 140.97,8 145.8,12.83 146.56,12.83 147.45,13.72 147.45,14.48 148.34,15.37 149.1,15.37 149.73,16 149.73,20.45 DATA4.9
LDR
  Bottom 0.254: IC1.17 20.7,72.39 14.22,78.87 12.57,78.87 CTRL.8
LFC0
  Bottom 0.254: IC14.16 144.4,85.09 145.8,83.69 147.45,83.69 STATE.11
LFC1
  Top 0.254: IC14.14 140.97,80.01 STATE.14
LFC2
  Top 0.254: IC15.18 141.35,59.69 151,69.34 151,82.68 STATE.13
LHLT  (via drill 0.61)
  Top 0.254: IC15.5 132.97,54.61 v136.53,58.17
  Bottom 0.254: v136.53,58.17 136.53,63.75 142.62,69.85 STATE.2
LIAC
  Top 0.254: IC14.7 129.92,80.01 136.14,73.79 138.18,73.79 146.05,81.66 STATE.12
LLDS
  Bottom 0.254: IC15.14 139.7,49.91 141.86,52.07 141.86,60.33 147.45,65.91 147.45,71.25 STATE.3
LMEM
  Bottom 0.254: IC1.16 20.7,74.93 14.22,81.41 12.57,81.41 CTRL.10
LR0
  Top 0.254: IC1.19 19.05,67.31 CTRL.1
LR1
  Bottom 0.254: IC1.18 13.97,69.85 CTRL.2
LR2
  Top 0.254: IC1.12 18.16,85.09 14.22,81.15 13.46,81.15 12.57,80.26 12.57,76.45 11.43,75.31 CTRL.4
LRD
  Top 0.254: IC15.3 132.08,60.07 145.8,73.79 147.45,73.79 STATE.5
LRST
  Bottom 0.254: IC15.9 135,44.45 138.94,48.39 140.72,48.39 142.37,50.04 142.37,60.07 148.59,66.29 STATE.1
LSP
  Top 0.254: IC1.14 19.05,80.01 CTRL.3
LSUP
  Top 0.254: IC14.3 135,90.17 136.14,91.31 141.48,91.31 147.45,85.34 147.45,81.15 STATE.9
LSYN
  Bottom 0.254: IC15.16 138.81,54.61 135.64,57.78 135.64,64.52 144.91,73.79 144.91,76.33 STATE.8
LUDS
  Bottom 0.254: IC15.12 139.7,44.83 142.88,48.01 142.88,59.82 149.73,66.67 149.73,72.9 149.1,73.53 147.19,73.53 STATE.4
LUSR
  Bottom 0.254: IC14.5 135,85.09 136.4,83.69 142.37,83.69 STATE.10
LWR
  Top 0.254: IC15.7 IC15.17 139.19,56.77 137.16,58.8 137.16,64.39 143.76,70.99 146.3,70.99 147.19,71.88 147.19,72.64 148.08,73.53 148.84,73.53 149.73,74.42 149.73,75.44 149.1,76.07 148.08,76.07 146.94,74.93 STATE.6
N$1
  Top 0.254: IC14.4 134.62,87.63 IC14.18
N$2
  Top 0.254: IC15.2 132.08,62.61 130.3,64.39 130.3,70.99 131.32,72.01 131.32,73.15 IC14.9
N$3
  Top 0.254: IC14.12 IC14.6
N$4
  Top 0.254: IC15.15 R1.2 !HALT.1
N$31
  Top 0.254: IC13.11 125.73,48.64 122.56,51.82 122.56,69.22 STP.3
N$32
  Bottom 0.254: IC13.8 125.73,41.02 127.51,42.8 127.51,65.53 STP.2
N$33
  Top 0.254: IC13.13 125.73,53.72 123.95,55.5 123.95,65.53 STP.1
R/!WB  (via drill 0.61)
  Top 0.254: v93.22,83.69 94.74,83.69 94.81,83.76 | 94.81,83.76 98.81,87.76 115.32,87.76 116.08,88.52 v116.08,90.55 | 120.27,35.56 128.27,35.56 v132.72,40.01 | 120.27,35.56 IC11.11 | JP3.1 75.95,2.54 76.2,2.29 132.72,2.29 136.4,5.97 136.4,24.51 134.11,26.8 126.87,26.8 121.67,32 120.78,32 120.27,32.51 120.27,35.56 | 94.81,83.76 98.68,79.88 99.57,79.88 100.46,78.99 100.46,76.45 113.16,63.75 113.16,59.18 116.33,56.01 116.33,45.34 117.35,44.32 122.43,44.32 124.71,42.04 127.51,42.04 131.32,45.85 138.56,45.85 IC15.13
  Bottom 0.254: IC9.5 91.44,81.92 v93.22,83.69 | v116.08,90.55 116.33,90.55 118.24,88.65 120.4,88.65 IC10.6 | IC15.13 v132.72,40.01
VCC  (via drill 0.61)
  Top 0.508: C3.1 IC3.20 29.08,6.22 29.08,27.94 | C2.1 IC2.20 29.08,30.61 29.08,27.94 | 29.08,27.94 42.04,27.94 43.31,26.67 59.82,26.67 60.96,27.81 64.64,27.81 IC6.20 C6.1 67.44,27.81 68.2,27.81 69.34,26.67 70.36,26.67 78.49,34.8 78.49,36.2 81.66,39.37 84.96,39.37 89.03,35.31 89.03,30.35 IC8.20 C8.1 | C10.1 IC10.16 113.16,76.07 113.16,64.77 114.3,63.63 C11.1 | IC9.16 C9.1 104.27,64.64 104.27,64.26 v107.7,60.83 | C12.1 IC12.20 | IC7.20 C7.1 94.11,58.55 94.61,58.55 v98.55,62.48 | C5.1 IC5.20 64.64,57.28 64.64,58.67 48.39,74.93 44.83,74.93 | C1.1 IC1.20 30.48,68.58 35.43,68.58 39.24,72.39 42.29,72.39 44.83,74.93 | C4.1 IC4.20 | JP8.4 76.2,95.25 | 76.2,95.25 JP8.2 | 76.2,95.25 C13.+ 86.49,95.38 118.87,95.38 120.02,96.52 135.89,96.52 IC14.20 C14.1 | C16.1 IC16.20 | C15.1 IC15.20 137.79,62.87 137.79,59.18 138.56,58.42 141.1,58.42 142.37,59.69 R1.1 | v43.69,78.36 44.7,77.34 44.7,75.06 44.83,74.93 | IC13.10 126.36,45.72 130.18,49.53 130.18,52.58 130.94,53.34 133.73,53.34 v137.54,57.15
  Bottom 0.508: IC13.10 123.83,47.62 123.83,48.9 IC13.12 123.83,52.7 123.83,53.98 | 123.83,53.98 IC13.14 | v107.7,60.83 109.35,60.83 IC11.20 C11.1 115.57,59.69 117.47,59.69 123.06,54.1 123.7,54.1 123.83,53.98 | IC8.20 91.44,32.38 89.03,34.8 89.03,45.72 90.3,46.99 92.58,46.99 93.98,48.39 | C7.1 93.98,48.39 | IC12.20 114.43,27.94 108.84,33.53 103.76,33.53 100.46,36.83 100.46,42.04 94.11,48.39 93.98,48.39 | IC9.16 99.31,62.48 v98.55,62.48 | C4.1 68.07,93.98 70.61,96.52 JP8.4 | C16.1 143.51,58.42 R1.1 150.62,65.53 150.62,86.11 141.48,95.25 C14.1 | v43.69,78.36 43.69,82.17 48.13,86.61 48.13,90.55 49.02,91.44 54.74,91.44 56.01,92.71 62.87,92.71 64.14,93.98 IC4.20 | v137.54,57.15 137.54,62.61 IC15.20

### Text on the board
tNames: 68010 FRONT PANEL PCB#2 | JLCJLCJLCJLC | DATA BUS LEDs / STATE & CTRL LEDs / CPU & USER CONTROL | 6-2021 | PA8PDP